# EasyEDA Pro project 2024-SS-ZT-2(第二次练习).eprj

# Schematic SCH

## Sheets
1 P1: Create Date: 2024-05-16; Page Name: P1; Project Name: 2024-SS-ZT-2(第二次练习); Schematic Name: SCH; Update Date: 2024-05-16; Company: 嘉立创EDA; Page Size: A4; Version: V1.0
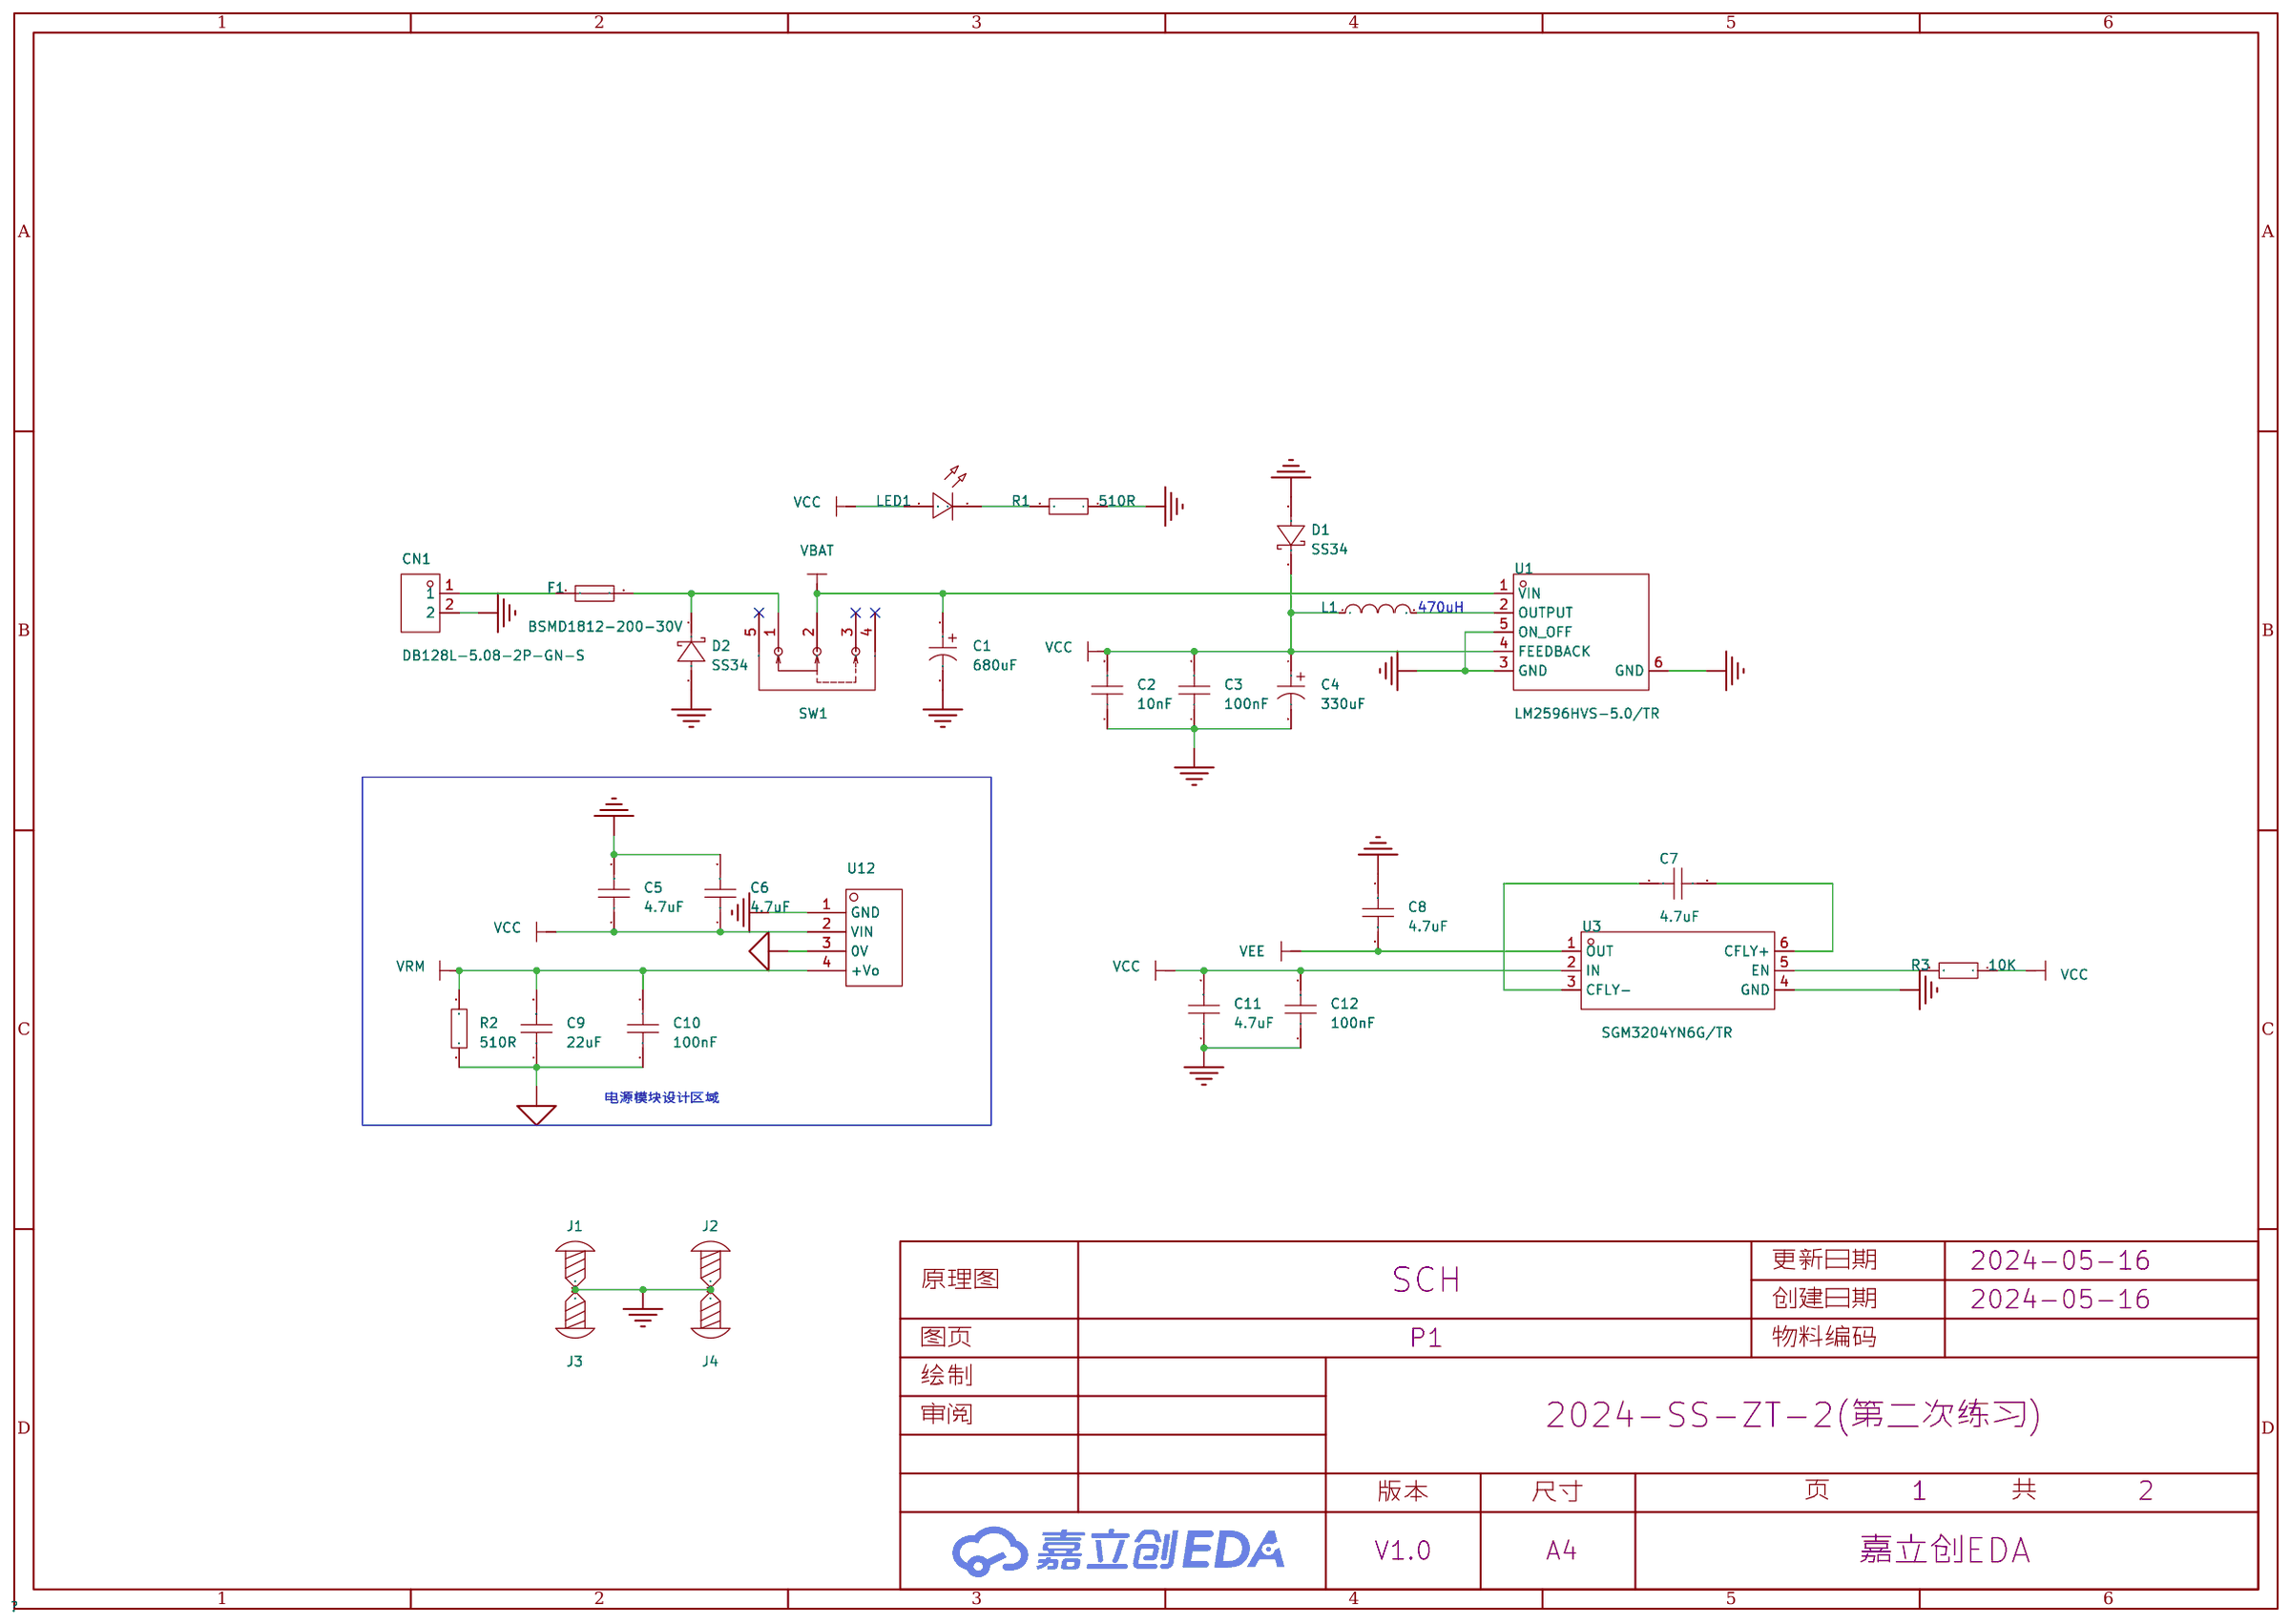
[diagram p0: P1]
2 P2: Page Name: P2; Company: EDA设计与开发
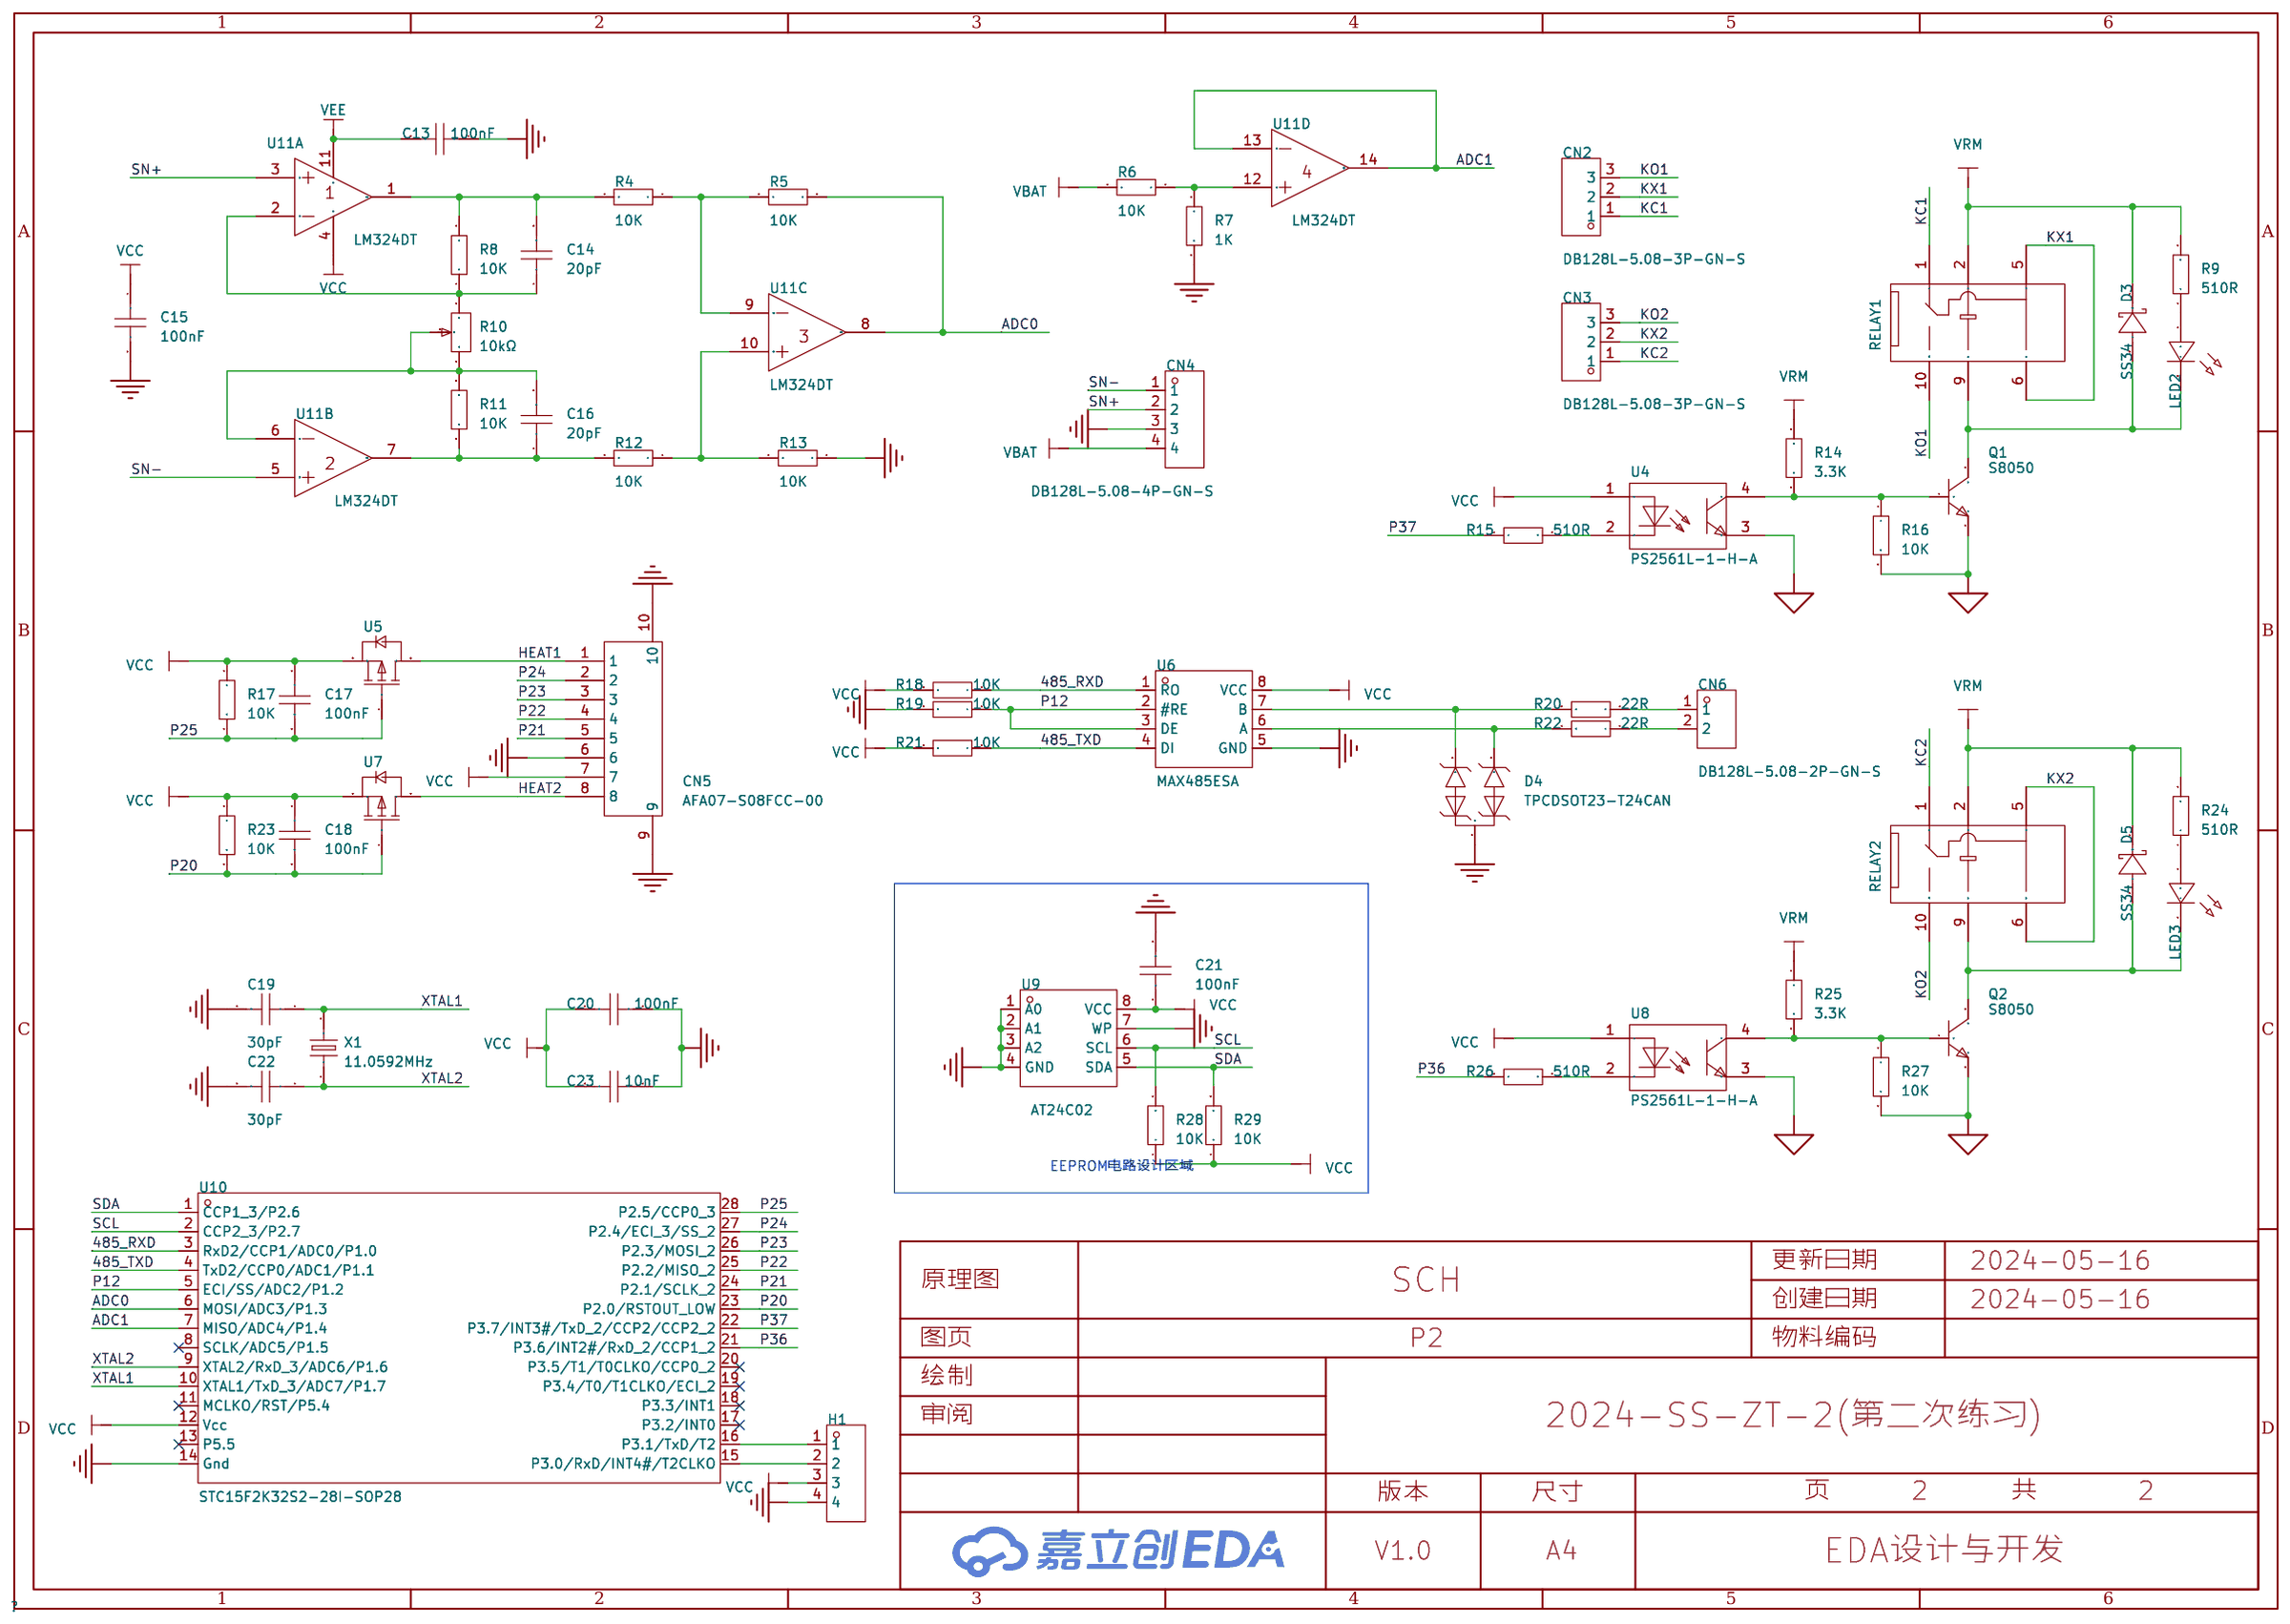
[diagram p1: P2]

## Parts
sheet P1
C1  680uF  [CAP-SMD_BD10.0-L10.3-W10.3-LS11.3-FD]
C2  10nF  [C0805]
C3  100nF  [C0805]
C4  330uF  [CAP-SMD_BD6.3-L6.6-W6.6-LS7.6-RD]
C5  4.7uF  [C1206]
C6  4.7uF  [C1206]
C7  4.7uF  [C1206]
C8  4.7uF  [C1206]
C9  22uF  [C1206]
C10  100nF  [C0805]
C11  4.7uF  [C1206]
C12  100nF  [C0805]
CN1  DB128L-5.08-2P-GN-S  [CONN-TH_2P-P5.08_DB128L-5.08-2P]
D1  SS34  [SMA_L4.3-W2.5-LS5.0-RD]
D2  SS34  [SMA_L4.3-W2.5-LS5.0-RD]
F1  BSMD1812-200-30V  [F1812]
J1  -  [M2螺丝]
J2  -  [M2螺丝]
J3  -  [M2螺丝]
J4  -  [M2螺丝]
L1  470uH  [IND-SMD_L12.0-W12.0_YPRH120X]
LED1  -  [LED_TH-3mm]
R1  510R  [R0805]
R2  510R  [R0805]
R3  10K  [R0805]
SW1  SK12D07VG4  [SW-TH_SK12D07VG4]
U1  LM2596HVS-5.0/TR  [TO-263-5_L10.2-W8.9-P1.70-LS15.2-BR]
U3  SGM3204YN6G/TR  [SOT-23-6_L2.9-W1.6-P0.95-LS2.8-BR]
U12  -  [TH_PCON]
sheet P2
C13  100nF  [C0805]
C14  20pF  [C0805]
C15  100nF  [C0805]
C16  20pF  [C0805]
C17  100nF  [C0805]
C18  100nF  [C0805]
C19  30pF  [C0805]
C20  100nF  [C0805]
C21  100nF  [C0805]
C22  30pF  [C0805]
C23  10nF  [C0805]
CN2  DB128L-5.08-3P-GN-S  [CONN-TH_DB128L-5.08-3P]
CN3  DB128L-5.08-3P-GN-S  [CONN-TH_DB128L-5.08-3P]
CN4  DB128L-5.08-4P-GN-S  [CONN-TH_4P_DB128L-5.08-4P-GN-S]
CN5  AFA07-S08FCC-00  [FPC-SMD_P1.00-8P_LCS-XJ-H2.5]
CN6  DB128L-5.08-2P-GN-S  [CONN-TH_2P-P5.08_DB128L-5.08-2P]
D3  SS34  [SMA_L4.3-W2.5-LS5.0-RD]
D4  TPCDSOT23-T24CAN  [SOT-23-3_L2.9-W1.3-P1.90-LS2.4-BR]
D5  SS34  [SMA_L4.3-W2.5-LS5.0-RD]
H1  -  [HDR-TH_4P-P2.54-V-F]
LED2  -  [LED_TH-3mm]
LED3  -  [LED_TH-3mm]
Q1  S8050  [SOT-23-3_L2.9-W1.3-P1.90-LS2.4-BR]
Q2  S8050  [SOT-23-3_L2.9-W1.3-P1.90-LS2.4-BR]
R4  10K  [R0805]
R5  10K  [R0805]
R6  10K  [R0805]
R7  1K  [R0805]
R8  10K  [R0805]
R9  510R  [R0805]
R10  10kΩ  [RES-ADJ-TH_3P-L10.0-W10.0-P2.50-BL-BS]
R11  10K  [R0805]
R12  10K  [R0805]
R13  10K  [R0805]
R14  3.3K  [R0805]
R15  510R  [R0805]
R16  10K  [R0805]
R17  10K  [R0805]
R18  10K  [R0805]
R19  10K  [R0805]
R20  22R  [R0805]
R21  10K  [R0805]
R22  22R  [R0805]
R23  10K  [R0805]
R24  510R  [R0805]
R25  3.3K  [R0805]
R26  510R  [R0805]
R27  10K  [R0805]
R28  10K  [R0805]
R29  10K  [R0805]
RELAY1  G5V-1 DC5  [RELAY-TH_G5V-1]
RELAY2  G5V-1 DC5  [RELAY-TH_G5V-1]
U4  PS2561L-1-H-A  [SOP-4_L6.5-W4.6-P2.54-LS9.6-TL]
U5  SI2301-ZE  [SOT-23-3_L2.9-W1.3-P1.90-LS2.4-BR]
U6  MAX485ESA  [SOP-8_L5.0-W4.0-P1.27-LS6.0-BL]
U7  SI2301-ZE  [SOT-23-3_L2.9-W1.3-P1.90-LS2.4-BR]
U8  PS2561L-1-H-A  [SOP-4_L6.5-W4.6-P2.54-LS9.6-TL]
U9  AT24C02  [SOP-8_L4.9-W3.9-P1.27-LS6.0-BL]
U10  STC15F2K32S2-28I-SOP28  [SOP-28_L17.9-W7.5-P1.27-LS10.3-BL]
U11  LM324DT  [SOIC-14_L8.7-W3.9-P1.27-LS6.0-BL]  (sections 1,2,3,4)
X1  11.0592MHz  [HC-49US_L11.5-W4.5-P4.88]

## Library data of the parts
C1 = 126RV0105: 容值:680uF;精度:±20%;额定电压:35V;纹波电流:380mA;; LCSC Part Name: 680uF ±20% 35V; Supplier Part: C7461236; Manufacturer: KNSCHA(科尼盛); Supplier Footprint: SMD,D10xL10.5mm; JLCPCB Part Class: Extended Part; Datasheet: https://atta.szlcsc.com/upload/public/pdf/source/20230711/6451BDCB5B323B6F7EF00B061BF0BEEC.pdf; Supplier: LCSC; Tolerance: ±20%; Rated Voltage: 35V; Ripple Current: 380mA; φD: 10mm; L: 10.5mm; Lifetime @ Temp: 2000hrs@105℃; Operating Temperature: -55℃~+105℃
C2 C3 C10 C12-C23 = CAP_0805: Supplier Footprint: 0805
C4 = 126RV0107: 容值:330uF;精度:±20%;额定电压:16V;纹波电流:170mA;; LCSC Part Name: 330uF ±20% 16V; Supplier Part: C7461238; Manufacturer: KNSCHA(科尼盛); Supplier Footprint: SMD,D6.3xL7.7mm; JLCPCB Part Class: Extended Part; Datasheet: https://atta.szlcsc.com/upload/public/pdf/source/20230711/6451BDCB5B323B6F7EF00B061BF0BEEC.pdf; Supplier: LCSC; Tolerance: ±20%; Rated Voltage: 16V; Ripple Current: 170mA; φD: 6.3mm; L: 7.7mm; Lifetime @ Temp: 2000hrs@105℃; Operating Temperature: -55℃~+105℃
C5-C9 C11 = CL31A226KOHNNNE: 容值:22uF;精度:±10%;额定电压:16V;材质(温度系数):X5R;; LCSC Part Name: 22uF ±10% 16V; Supplier Part: C90146; Manufacturer: SAMSUNG(三星); Supplier Footprint: 1206; JLCPCB Part Class: 扩展库; Datasheet: https://atta.szlcsc.com/upload/public/pdf/source/20161228/1482890861309.pdf; Supplier: LCSC; Tolerance: ±10%; Voltage Rated: 16V; Temperature Coefficient: X5R
CN1 CN6 = DB128L-5.08-2P-GN-S: 结构:1x2P;间距:5.08mm;颜色:绿色;安装方式:直插;额定电流:18A;额定电压:250V;排数:1;线规 - AWG:12~30;线规 - 平方毫米:2.5;每排PIN数:2;工作温度范围:-40℃~+105℃;; LCSC Part Name: 5.08mm 1x2P 排数:1 每排P数:2 直插; Supplier Part: C395868; Manufacturer: DORABO(地博电气); Supplier Footprint: 插件,P=5.08mm; JLCPCB Part Class: 扩展库; Datasheet: https://atta.szlcsc.com/upload/public/pdf/source/20230106/B067FE0E641A396A370D47F93C345689.pdf; Supplier: LCSC; Structure: 1x2P; Pitch: 5.08mm; Color: 绿色; Mounting Style: 直插; Current Rating (Max): 18A; Voltage Rating (Max): 250V; Number of Pins: 2P; Number of Rows: 1; Wire Gauge - AWG: 12~30; Wire Gauge - mm2: 2.5; Number of PINs Per Row: 2; Operating Temperature Range: -40℃~+105℃
D1-D3 D5 = SS34_C727060: 二极管配置:独立式;正向压降(Vf):550mV@3A;直流反向耐压(Vr):40V;平均整流电流(Io):3A;; LCSC Part Name: 电压:40V 电流:3A; Supplier Part: C727060; Manufacturer: TWGMC(台湾迪嘉); Supplier Footprint: SMA(DO-214AC); JLCPCB Part Class: 扩展库; Datasheet: https://atta.szlcsc.com/upload/public/pdf/source/20200828/C727059_6599B6CAC5F3238B9C33E46794659DBE.pdf; Supplier: LCSC; Diode Configuration: 独立式; Forward Voltage (Vf@If): 550mV@3A; Reverse Voltage (Vr): 40V; Average Rectified Current (Io): 3A; Reverse Leakage Current (Ir): 500uA@40V
F1 = BSMD1812-200-30V: 最大电压:30V;最大电流:40A;保持电流:2A;跳闸电流:4A;; LCSC Part Name: 30V 2A 1812自恢复; Supplier Part: C960026; Manufacturer: BHFUSE(佰宏); Supplier Footprint: 1812; JLCPCB Part Class: 扩展库; Datasheet: https://atta.szlcsc.com/upload/public/pdf/source/20230512/6ED7FF50F668B3AF958C55F12246A840.pdf; Supplier: LCSC; Operating Voltage (Max): 30V; Current Rating (Max): 40A; Hold Current: 2A; Trip Current: 4A; Power Dissipation: 1W; Resistance - Initial (Ri) (Min): 20mΩ; Resistance - Post Trip (R1) (Max): 100mΩ; Maximum Time to Trip: 2s; Operating Temperature: -40℃~+85℃
J1-J4 = M2螺丝: Supplier Footprint: 插件
L1 = YPRH1209-471M: 电感值:470uH;精度:±20%;额定电流:1.06A;; LCSC Part Name: 470uH ±20%; Supplier Part: C718309; Manufacturer: YJYCOIN(益嘉源); Supplier Footprint: SMD,12x12mm; JLCPCB Part Class: 扩展库; Datasheet: https://atta.szlcsc.com/upload/public/pdf/source/20200623/C339955_D39FA66995A9BB8553FDBD7D9E6E5CB5.pdf; Supplier: LCSC; Tolerance: ±20%; Rated Current: 1.06A; DC Resistance (DCR): 471mΩ
LED1 = LED_TH-R_3mm: Supplier Footprint: 插件
R1-R9 R11-R29 = Res_0805: Supplier Footprint: 0805
SW1 = SK12D07VG4: 电路结构:单刀双掷;安装方式:侧插;额定电流(DC):500mA;额定电压(DC):50V;额定电流(AC):-;额定电压(AC):-;机械寿命:5千次;; LCSC Part Name: 3脚2档位 卧插 滑动开关; Supplier Part: C393937; Manufacturer: SHOU HAN(首韩); Supplier Footprint: 插件; JLCPCB Part Class: 扩展库; Datasheet: https://atta.szlcsc.com/upload/public/pdf/source/20190521/C393937_939FE26E571CC67D2D532E953108A1B0.pdf; Supplier: LCSC; Circuit: 单刀双掷; Actuator Style: 矩形柱状; Pin Style: PC引脚; Switch Height: 8.8mm; Mounting Style: 侧插; Current Rating (DC): 500mA; Voltage Rating (DC): 50V; Mechanical Life: 5千次
U1 = LM2596HVS-5.0/TR: Supplier Part: C7421039; Manufacturer: HGSEMI(华冠); Supplier Footprint: TO-263-5; Datasheet: https://atta.szlcsc.com/upload/public/pdf/source/20230608/50F81A07F1CB4120FC66F79925E72406.pdf; Supplier: LCSC
U3 = SGM3204YN6G/TR: 功能类型:-;输入电压:1.4V~5.5V;输出电压:-5.5V~-1.4V;输出电流(最大值):200mA;; Supplier Part: C194031; Manufacturer: SGMICRO(圣邦微); Supplier Footprint: SOT-23-6; JLCPCB Part Class: 扩展库; Datasheet: https://atta.szlcsc.com/upload/public/pdf/source/20180627/C194031_755051E53122D645C36CF727711B963E.pdf; Supplier: LCSC; Input Voltage: 1.4V~5.5V; Output Voltage: -5.5V~-1.4V; Output Current (Max): 200mA; Switching Frequency: 950kHz; Number of Outputs: 1; Switch tube (built-in/external): 内置
U12 = PCON
CN2 CN3 = DB128L-5.08-3P-GN-S: 结构:1x3P;间距:5.08mm;颜色:绿色;安装方式:直插;额定电流:18A;额定电压:250V;排数:1;线规 - AWG:12~30;线规 - 平方毫米:2.5;每排PIN数:3;工作温度范围:-40℃~+105℃;; LCSC Part Name: 5.08mm 1x3P 排数:1 每排P数:3 直插; Supplier Part: C395869; Manufacturer: DORABO(地博电气); Supplier Footprint: 插件,P=5.08mm; JLCPCB Part Class: 扩展库; Datasheet: https://atta.szlcsc.com/upload/public/pdf/source/20230106/B067FE0E641A396A370D47F93C345689.pdf; Supplier: LCSC; Structure: 1x3P; Pitch: 5.08mm; Color: 绿色; Mounting Style: 直插; Current Rating (Max): 18A; Voltage Rating (Max): 250V; Number of Pins: 3P; Number of Rows: 1; Wire Gauge - AWG: 12~30; Wire Gauge - mm2: 2.5; Number of PINs Per Row: 3; Operating Temperature Range: -40℃~+105℃
CN4 = DB128L-5.08-4P-GN-S: 结构:1x4P;间距:5.08mm;颜色:绿色;安装方式:直插;额定电流:18A;额定电压:250V;排数:1;线规 - AWG:12~30;线规 - 平方毫米:2.5;每排PIN数:4;工作温度范围:-40℃~+105℃;; LCSC Part Name: 5.08mm 1x4P 排数:1 每排P数:4 直插; Supplier Part: C2827883; Manufacturer: DORABO(地博电气); Supplier Footprint: 插件,P=5.08mm; JLCPCB Part Class: 扩展库; Datasheet: https://atta.szlcsc.com/upload/public/pdf/source/20230106/B067FE0E641A396A370D47F93C345689.pdf; Supplier: LCSC; Structure: 1x4P; Pitch: 5.08mm; Color: 绿色; Mounting Style: 直插; Current Rating (Max): 18A; Voltage Rating (Max): 250V; Number of Pins: 4P; Number of Rows: 1; Wire Gauge - AWG: 12~30; Wire Gauge - mm2: 2.5; Number of PINs Per Row: 4; Operating Temperature Range: -40℃~+105℃
CN5 = AFA07-S08FCC-00: 锁定特性:抽屉式;触点类型:下接;触点数量:8P;间距:1mm;安装类型:卧贴;; LCSC Part Name: 间距:1mm P数:8P 抽屉式 下接; Supplier Part: C262342; Manufacturer: JS(钜硕电子); Supplier Footprint: SMD,P=1mm,卧贴; JLCPCB Part Class: 扩展库; Datasheet: https://atta.szlcsc.com/upload/public/pdf/source/20191217/C262716_30B15E9A77BFCA4A54741C92DB3BE8CC.pdf; Supplier: LCSC; Locking Feature: 抽屉式; Contact Type: 下接; Number of Contacts: 8P; Pitch: 1mm; Mounting Type: 卧贴; FFC, FCB Thickness: 0.3mm; Height Above Board: 2.5mm
D4 = TPCDSOT23-T24CAN: Supplier Part: C970033; Manufacturer: TECH PUBLIC(台舟); Supplier Footprint: SOT-23; JLCPCB Part Class: 扩展库; Datasheet: https://atta.szlcsc.com/upload/public/pdf/source/20230522/C1F3B36253468277A14BE124FFAB154C.pdf; Supplier: LCSC
H1 = HDR-F_2.54_1x4P: Supplier Part: C2718488; Supplier Footprint: 插件
LED2 LED3 = LED_TH-G_3mm: Supplier Footprint: 插件
Q1 Q2 = S8050_C2891804: 晶体管类型:NPN;集电极电流(Ic):500mA;集射极击穿电压(Vceo):25V;功率(Pd):300mW;; LCSC Part Name: NPN 电流:500mA 耐压:25V; Supplier Part: C2891804; Manufacturer: YONGYUTAI(永裕泰); Supplier Footprint: SOT-23; JLCPCB Part Class: Extended Part; Datasheet: https://atta.szlcsc.com/upload/public/pdf/source/20210901/5347316A10609C628D4D69AE01446E5B.pdf; Supplier: LCSC; Transistor Type: NPN; Collector Current (Ic): 500mA; Collector-Emitter Breakdown Voltage (Vceo): 25V; Power Dissipation (Pd): 300mW; Collector Cut-Off Current (Icbo): 1uA; Collector-Emitter Saturation Voltage (VCE(sat)@Ic,Ib): 500mV@500mA,50mA
R10 = 3296W-1-203LF: 阻值:20kΩ;精度:±10%;功率:500mW;温度系数:±100ppm/℃;; LCSC Part Name: 20kΩ ±10%; Supplier Part: C34845; Manufacturer: BOURNS; Supplier Footprint: 插件; JLCPCB Part Class: 扩展库; Datasheet: https://atta.szlcsc.com/upload/public/pdf/source/20151026/1457707506403.pdf; Supplier: LCSC; Tolerance: ±10%; Power(Watts): 500mW; Temperature Coefficient: ±100ppm/℃; Turns: 25
RELAY1 RELAY2 = G5V-1 DC5: 线圈电压:5V;触点形式:一组转换:1C(单刀双掷-转换);触点容量(电阻负载):-;最大切换电压:125V@AC；60V@DC;最大切换电流:1A;; LCSC Part Name: 继电器G5V-1-5VDC; Supplier Part: C28695; Manufacturer: OMRON(欧姆龙); Supplier Footprint: DIP,7.5x12.5mm; JLCPCB Part Class: 扩展库; Supplier: LCSC; Coil Voltage: 5V; Contact Form: 一组转换:1C(单刀双掷-转换); Maximum Switching Voltage: 125V@AC；60V@DC; Contact Material: 银+镀金; Maximum Switching Current: 1A; Operate Time: 5ms; Release Time: 5ms; Operating Temperature: -40℃~+70℃
U4 U8 = PS2561L-1-H-A: Supplier Part: C145672; Manufacturer: California Eastern Laboratories; Supplier Footprint: SOP-4-2.54mm; JLCPCB Part Class: 扩展库; Datasheet: https://atta.szlcsc.com/upload/public/pdf/source/20180125/C145673_15168615431091301608.pdf; Supplier: LCSC
U5 U7 = SI2301-ZE: 类型:P沟道;漏源电压(Vdss):20V;连续漏极电流(Id):2.3A;功率(Pd):700mW;导通电阻(RDS(on)@Vgs,Id):126mΩ@4.5V;阈值电压(Vgs(th)@Id):1V@250uA;; LCSC Part Name: P沟道 耐压:20V 电流:2.3A; Supplier Part: C5261052; Manufacturer: HXY MOSFET(华轩阳电子); Supplier Footprint: SOT-23; JLCPCB Part Class: 扩展库; Datasheet: https://atta.szlcsc.com/upload/public/pdf/source/20230515/2FF2907841563ED329594D3237822724.pdf; Supplier: LCSC; Type: P沟道; Drain Source Voltage (Vdss): 20V; Continuous Drain Current (Id): 2.3A; Power Dissipation (Pd): 700mW; Drain Source On Resistance (RDS(on)@Vgs,Id): 126mΩ@4.5V; Gate Threshold Voltage (Vgs(th)@Id): 1V@250uA; Input Capacitance (Ciss@Vds): 285pF
U6 = MAX485ESA_C668206: Supplier Part: C668206; Manufacturer: UMW(友台半导体); Supplier Footprint: SOP-8; JLCPCB Part Class: 扩展库; Datasheet: https://atta.szlcsc.com/upload/public/pdf/source/20231109/489730AE87B90C4B6B8CE65C07B1054C.pdf; Supplier: LCSC
U9 = AT24C02_C7470930: 接口类型:I2C;存储容量:2Kbit;时钟频率(fc):400kHz~1MHz;; LCSC Part Name: AT24C02  2Kbit 12C; Supplier Part: C7470930; Manufacturer: HXY MOSFET(华轩阳电子); Supplier Footprint: SOP-8; JLCPCB Part Class: 扩展库; Datasheet: https://atta.szlcsc.com/upload/public/pdf/source/20230913/748AF0FF0068DF582FAC58AD968E8A28.pdf; Supplier: LCSC; Interface Type: I2C; Memory Size: 2Kbit; Clock Frequency (fc): 400kHz~1MHz; Supply Voltage: 1.8V~5.5V; Data Retention - TDR (Year): 100年
U10 = STC15F2K32S2-28I-SOP28: LCSC Part Name: STC15F2K32S2-28I- SOP28; Supplier Part: C194605; Manufacturer: STC(宏晶); Supplier Footprint: SOP-28-300mil; JLCPCB Part Class: 扩展库; Datasheet: https://atta.szlcsc.com/upload/public/pdf/source/20180730/C194606_29BB2C4DE21484D9E9511E7CB40FB26F.pdf; Supplier: LCSC
U11 = LM324DT: 放大器数:四路;增益带宽积(GBP):1.3MHz;输入偏置电流(Ib):20nA;压摆率(SR):0.4V/us;带宽(-3db):-;; Supplier Part: C71035; Manufacturer: ST(意法半导体); Supplier Footprint: SOIC-14; JLCPCB Part Class: 基础库; Datasheet: https://atta.szlcsc.com/upload/public/pdf/source/20160408/1460100649718.pdf; Supplier: LCSC; Number of Circuits: 四路; Gain Bandwidth Product(GBP): 1.3MHz; Current - Input Bias(Ib): 20nA; Slew Rate(SR): 0.4V/us; Output Current: 40mA; Supply Current: 1.5mA; Operating Temperature: 0℃~+70℃
X1 = TAXD11.0592M2GLFBET2T: 晶振类型:直插晶振;频率:11.0592MHz;常温频差:±30ppm;外接负载电容:20pF;频率稳定度(全温):±30ppm;; LCSC Part Name: 11.0592MHz ±30ppm 20pF; Supplier Part: C127675; Manufacturer: YJX(雅晶鑫); Supplier Footprint: HC-49S; JLCPCB Part Class: 扩展库; Datasheet: https://atta.szlcsc.com/upload/public/pdf/source/20170914/C127676_1505359415156967690.pdf; Supplier: LCSC; Crystal Type: 直插晶振; Normal temperature Frequency Tolerance: ±30ppm; External load capacitor: 20pF; Frequency Stability(Full temperature range): ±30ppm; Equivalent Series Resistance (ESR): 50Ω; Operating Temperature: -20℃~+70℃

## Nets
GND: C1.2 C2.1 C3.1 C4.2 C5.2 C6.2 C8.1 C11.1 C12.1 C13.1 C15.2 C19.2 C20.1 C21.2 C22.2 C23.1 CN1.2 CN4.3 CN5.6 CN5.9 CN5.10 D1.2(A) D2.2(A) D4.3 H1.4 J1.1 J2.1 J3.1 J4.1 R1.1 R7.2 R13.1 R19.2 U1.3(GND) U1.5(ON_OFF) U1.6(GND) U3.4(GND) U6.5(GND) U9.1(A0) U9.2(A1) U9.3(A2) U9.4(GND) U9.7(WP) U10.14(Gnd) U12.1(GND)
VBAT: C1.1 CN4.4 R6.2 SW1.2 U1.1(VIN)
VCC: C2.2 C3.2 C4.1 C5.1 C6.1 C11.2 C12.2 C15.1 C17.1 C18.1 C20.2 C21.1 C23.2 CN5.7 D1.1(C) H1.3 L1.1 LED1.1(C) R3.1 R17.1 R18.2 R21.2 R23.1 R28.1 R29.1 U1.4(FEEDBACK) U3.2(IN) U4.1 U5.2(S) U6.8(VCC) U7.2(S) U8.1 U9.8(VCC) U10.12(Vcc) U11.4(VCC+) U12.2(VIN)
VEE: C8.2 C13.2 U3.1(OUT) U11.11(VCC-)
0: C9.1 C10.1 Q1.2(E) Q2.2(E) R2.1 R16.2 R27.2 U4.3 U8.3 U12.3(0V)
485_RXD: R18.1 U6.1(RO) U10.3(RxD2/CCP1/ADC0/P1.0)
485_TXD: R21.1 U6.4(DI) U10.4(TxD2/CCP0/ADC1/P1.1)
ADC0: R5.1 U10.6(MOSI/ADC3/P1.3) U11.8(OUT3)
ADC1: U10.7(MISO/ADC4/P1.4) U11.13(IN4-) U11.14(OUT4)
HEAT1: CN5.1 U5.3(D)
HEAT2: CN5.8 U7.3(D)
KC1: CN2.1 RELAY1.1
KC2: CN3.1 RELAY2.1
KO1: CN2.3 RELAY1.10
KO2: CN3.3 RELAY2.10
KX1: CN2.2 RELAY1.5 RELAY1.6
KX2: CN3.2 RELAY2.5 RELAY2.6
P12: R19.1 U6.2(#RE) U6.3(DE) U10.5(ECI/SS/ADC2/P1.2)
P20: C18.2 R23.2 U7.1(G) U10.23(P2.0/RSTOUT_LOW)
P21: CN5.5 U10.24(P2.1/SCLK_2)
P22: CN5.4 U10.25(P2.2/MISO_2)
P23: CN5.3 U10.26(P2.3/MOSI_2)
P24: CN5.2 U10.27(P2.4/ECI_3/SS_2)
P25: C17.2 R17.2 U5.1(G) U10.28(P2.5/CCP0_3)
P36: R26.1 U10.21(P3.6/INT2#/RxD_2/CCP1_2)
P37: R15.1 U10.22(P3.7/INT3#/TxD_2/CCP2/CCP2_2)
SCL: R28.2 U9.6(SCL) U10.2(CCP2_3/P2.7)
SDA: R29.2 U9.5(SDA) U10.1(CCP1_3/P2.6)
SN+: CN4.2 U11.3(IN1+)
SN-: CN4.1 U11.5(IN2+)
VRM: C9.2 C10.2 D3.1(C) D5.1(C) R2.2 R9.2 R14.1 R24.2 R25.1 RELAY1.2 RELAY2.2 U12.4(+Vo)
XTAL1: C19.1 U10.10(XTAL1/TxD_3/ADC7/P1.7) X1.2
XTAL2: C22.1 U10.9(XTAL2/RxD_3/ADC6/P1.6) X1.1
$1N5406: CN1.1 F1.1
$1N6010: L1.2 U1.2(OUTPUT)
$1N7874: R3.2 U3.5(EN)
$1N8048: C7.2 U3.6(CFLY+)
$1N8053: C7.1 U3.3(CFLY-)
$1N8284: LED1.2(A) R1.2
$1N8627: D2.1(C) F1.2 SW1.1
$2N2031: C16.1 R11.1 R12.2 U11.7(OUT2)
$2N2092: R12.1 R13.2 U11.10(IN3+)
$2N2099: R4.1 R5.2 U11.9(IN3-)
$2N2266: C14.1 R8.1 R10.1 U11.2(IN1-)
$2N2273: C14.2 R4.2 R8.2 U11.1(OUT1)
$2N2314: C16.2 R10.2 R10.3 R11.2 U11.6(IN2-)
$2N3023: CN6.1 R20.1
$2N3053: CN6.2 R22.1
$2N3244: D4.1 R22.2 U6.6(A)
$2N3251: D4.2 R20.2 U6.7(B)
$2N3377: R15.2 U4.2
$2N3466: Q1.1(B) R14.2 R16.1 U4.4
$2N4164: R26.2 U8.2
$2N4168: Q2.1(B) R25.2 R27.1 U8.4
$2N4738: LED2.1(C) R9.1
$2N4742: D3.2(A) LED2.2(A) Q1.3(C) RELAY1.9
$2N4893: LED3.1(C) R24.1
$2N4914: D5.2(A) LED3.2(A) Q2.3(C) RELAY2.9
$2N5025: R6.1 R7.1 U11.12(IN4+)
$2N7138: H1.1 U10.16(P3.1/TxD/T2)
$2N7141: H1.2 U10.15(P3.0/RxD/INT4#/T2CLKO)

Not connected (* = marked no-connect by the designer): SW1 3* 4* 5*; U10 8(SCLK/ADC5/P1.5)* 11(MCLKO/RST/P5.4)* 13(P5.5)* 17(P3.2/INT0)* 18(P3.3/INT1)* 19(P3.4/T0/T1CLKO/ECI_2)* 20(P3.5/T1/T0CLKO/CCP0_2)*

## Notes on the sheets
sheet 1
- 电源模块设计区域
sheet 2
- EEPROM电路设计区域

# Board PCB
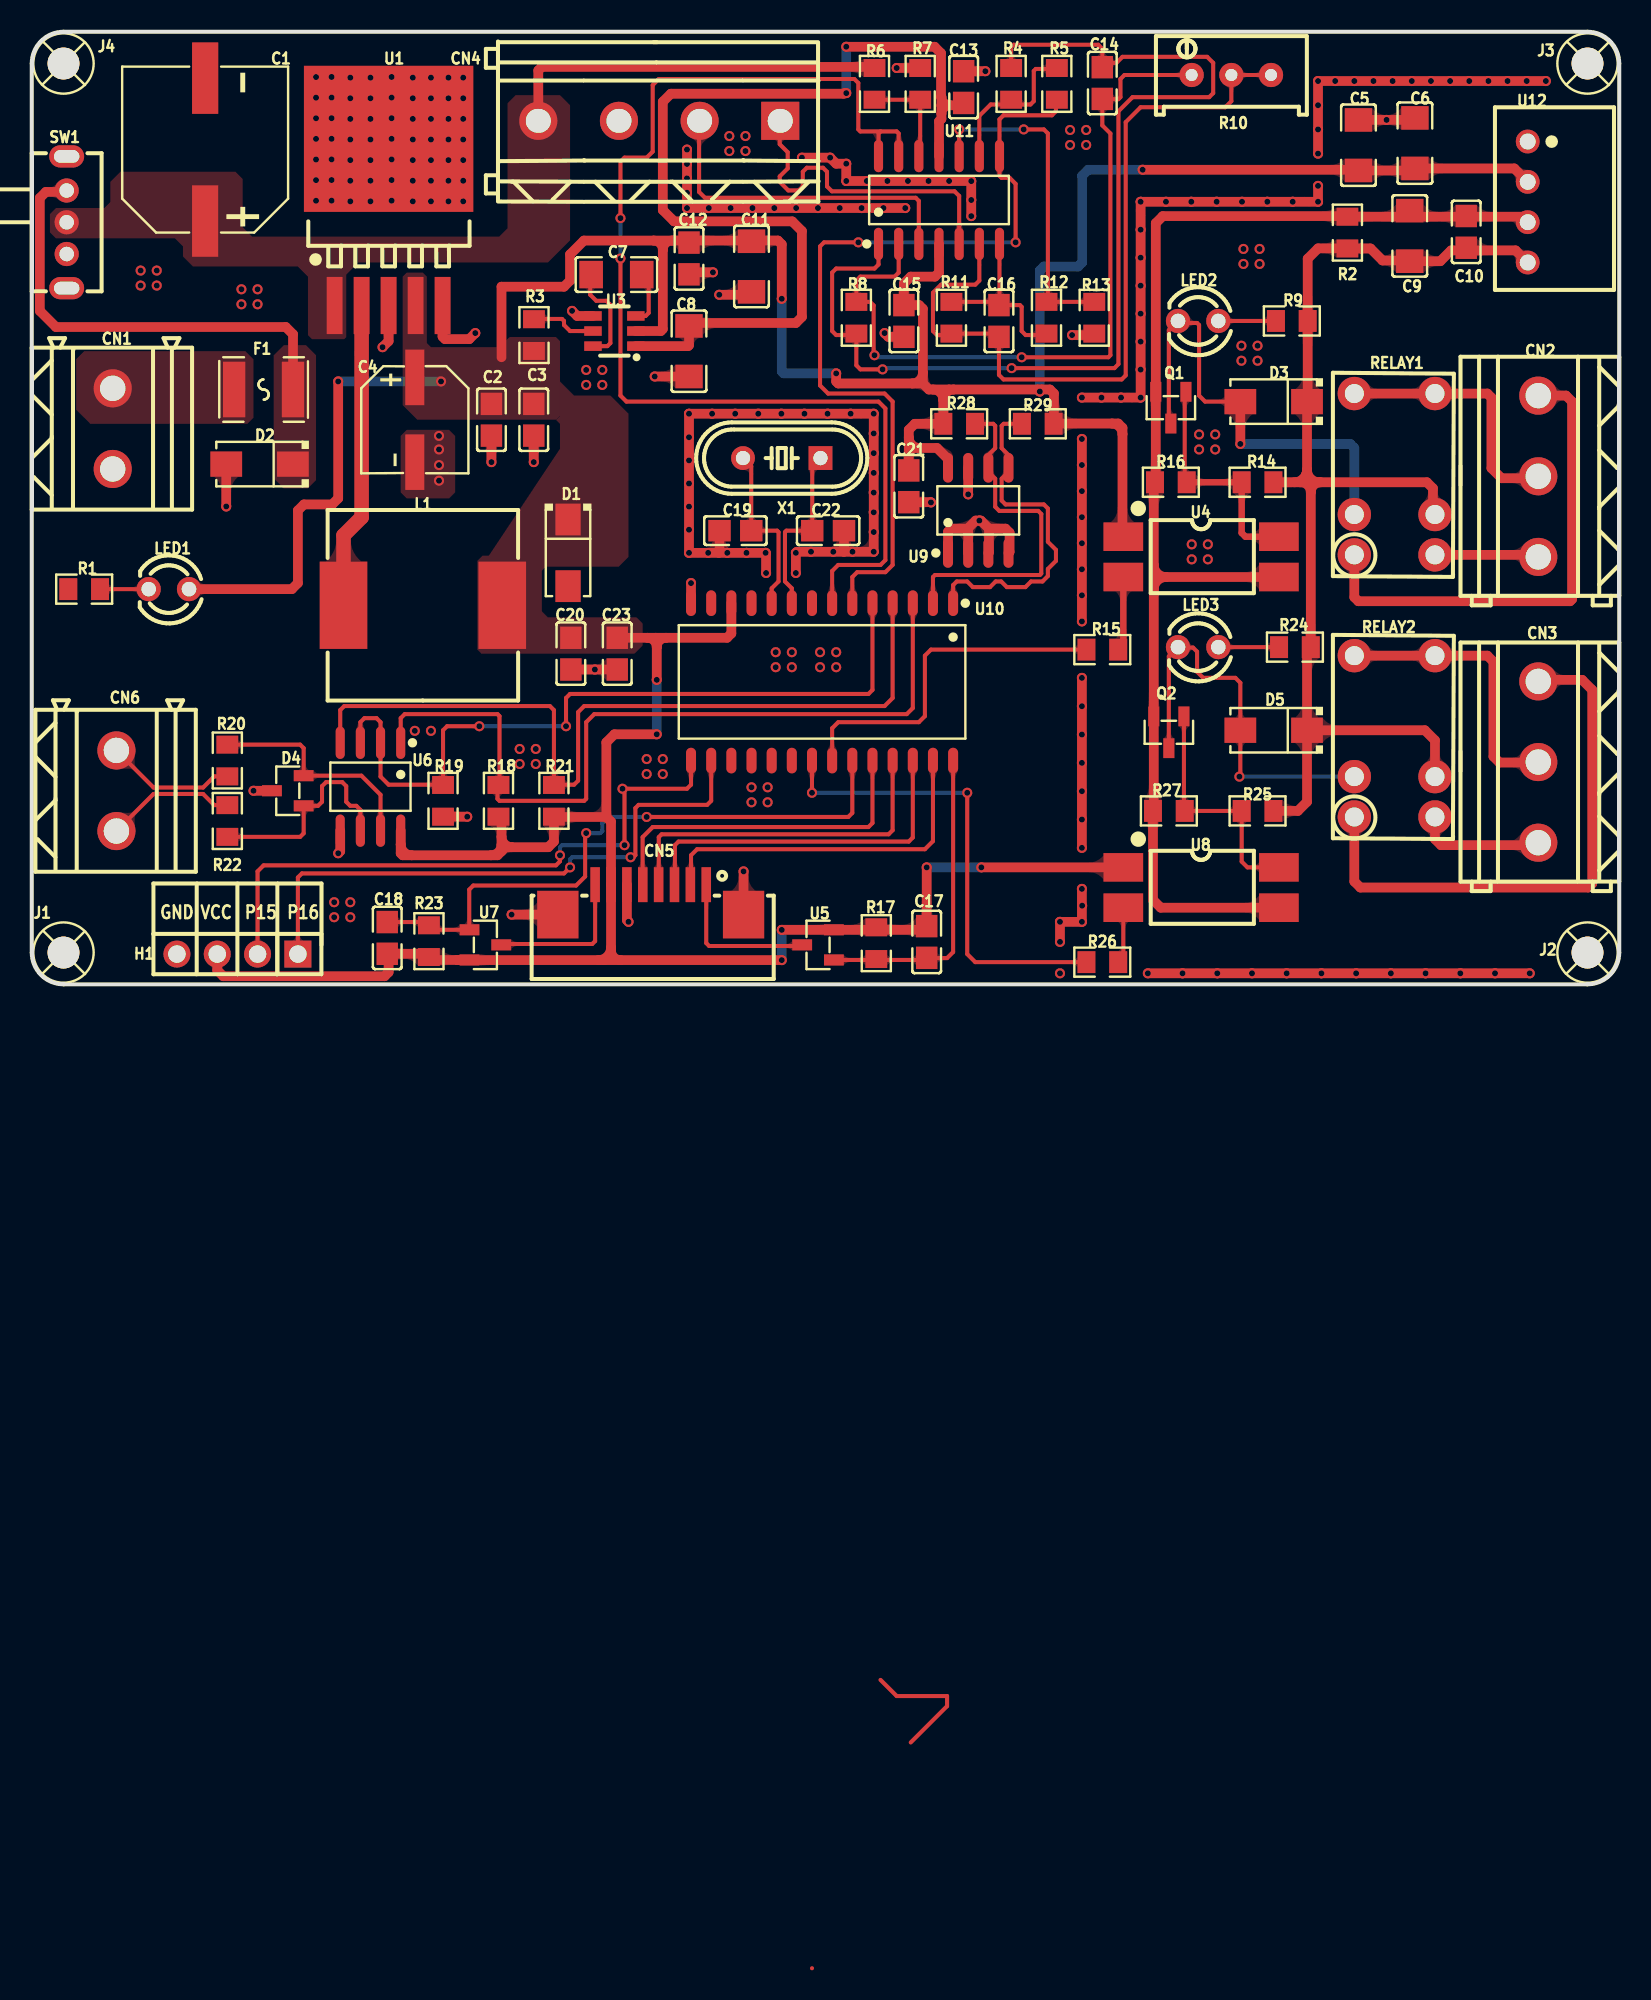
[diagram p2: board, top side]
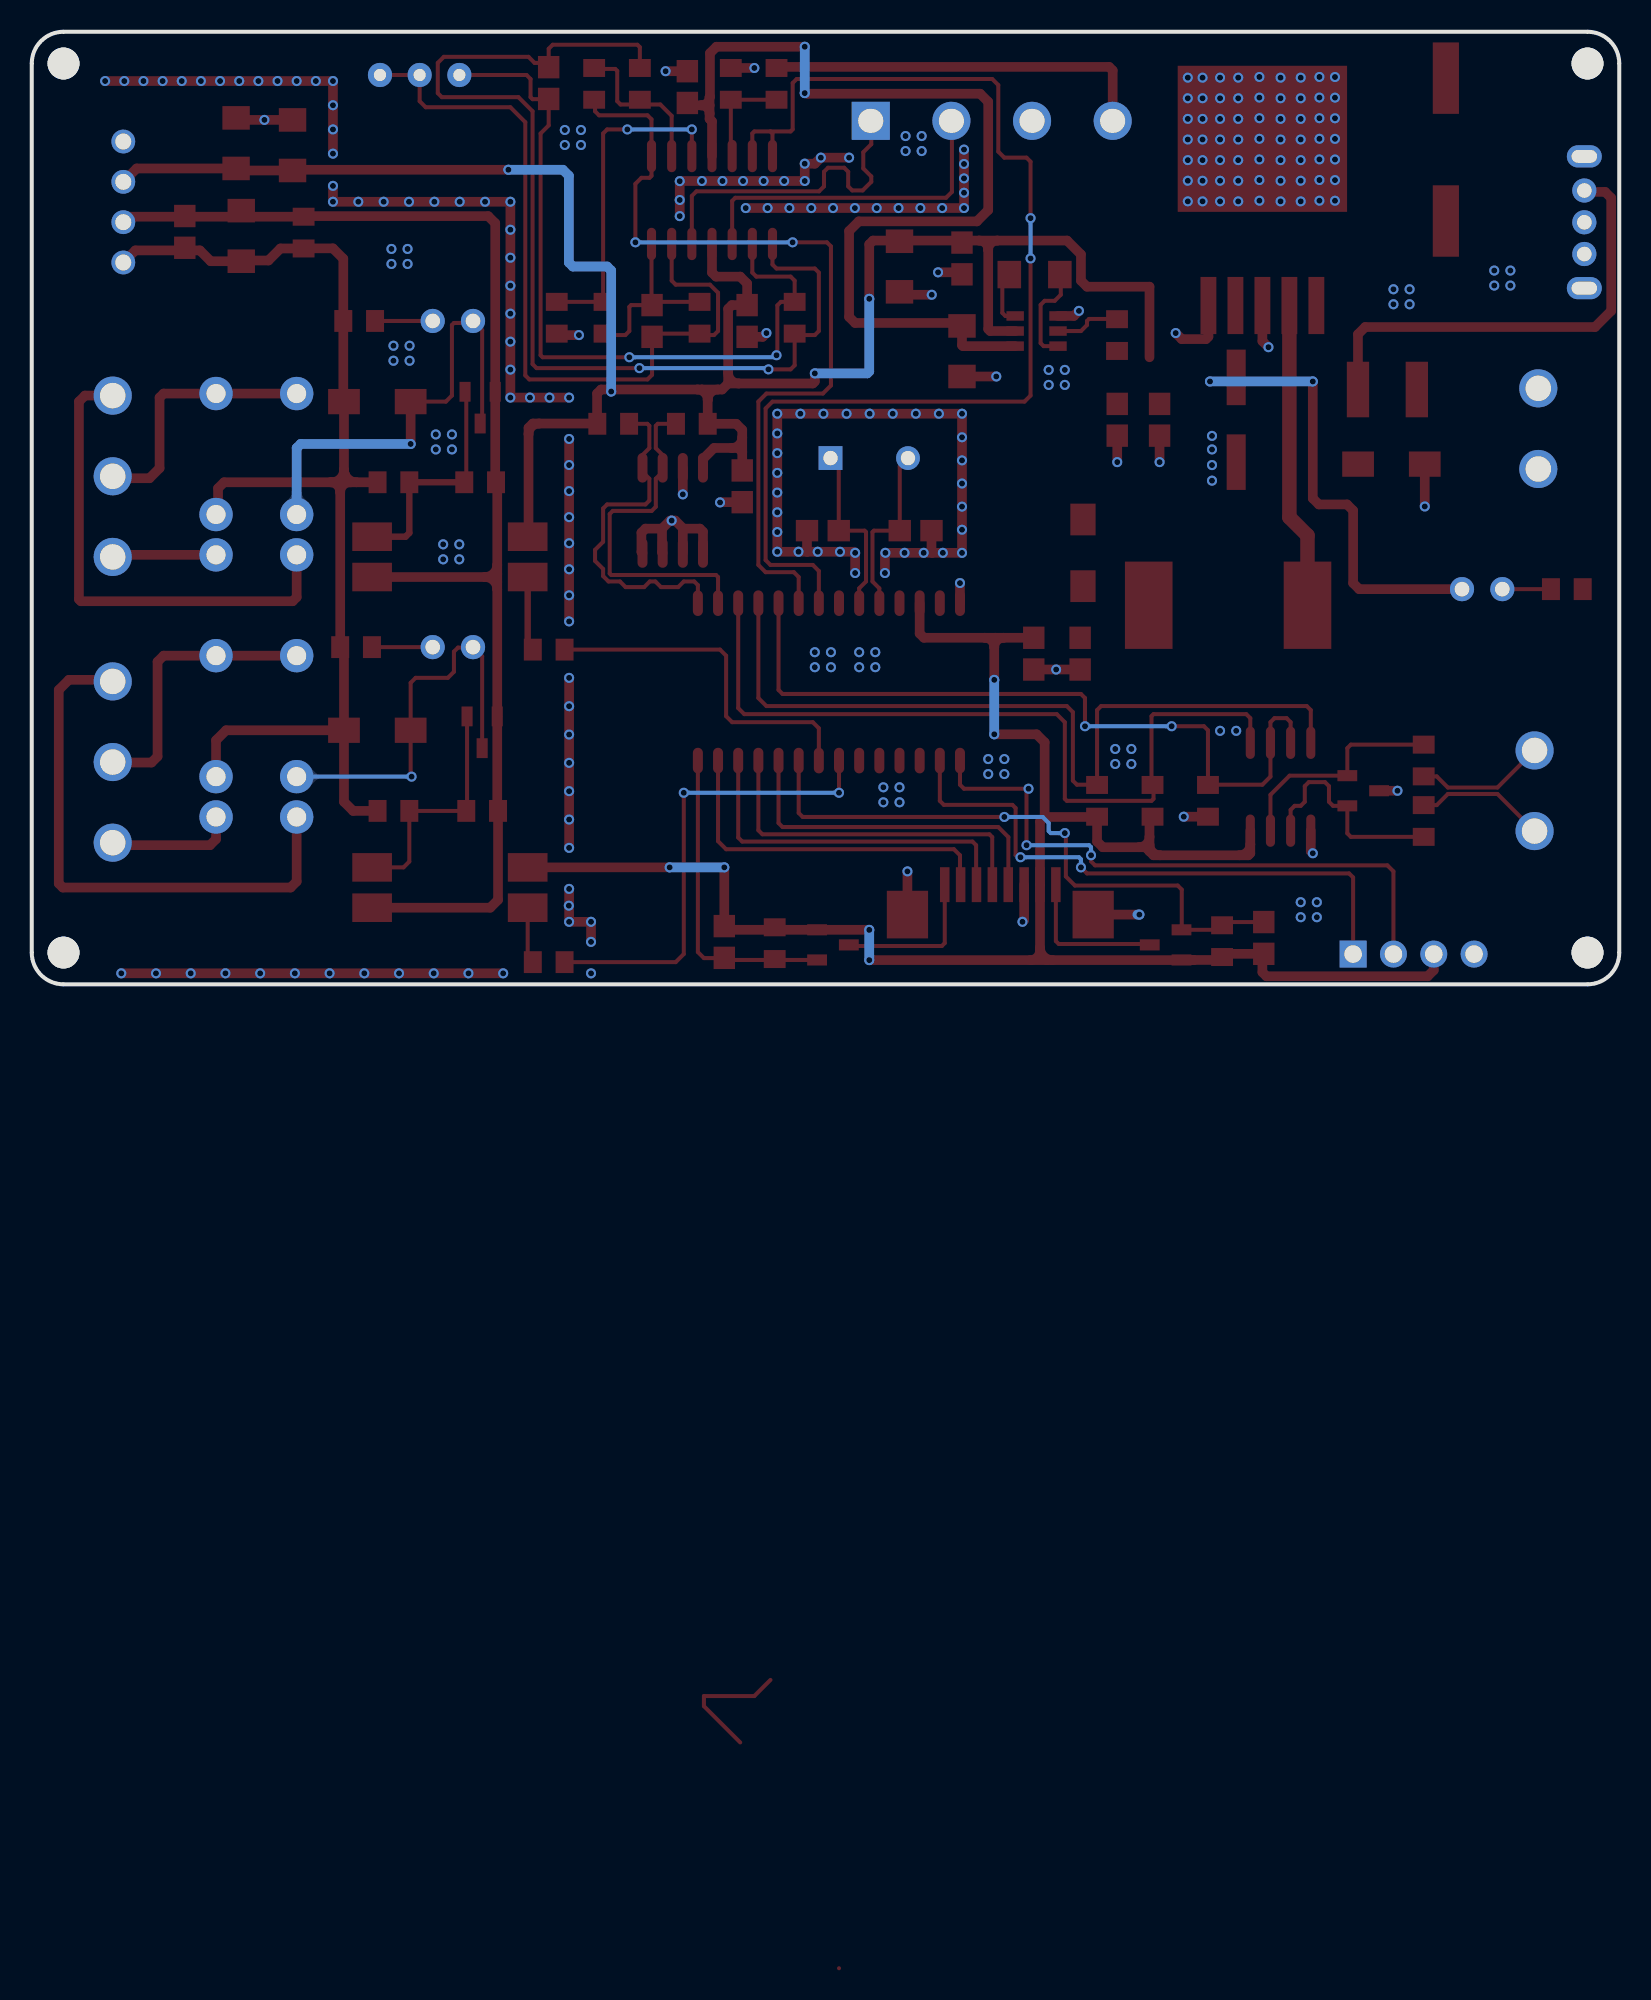
[diagram p3: board, bottom side, seen from below]

Outline 100 x 60 mm; copper layers: Top Layer, Bottom Layer. Coordinates in mm from the lower left corner of the outline.
Outline path: 0,58 0,2 arc(0.59,0.59) 2,0 98,0 arc(99.41,0.59) 100,2 100,58 arc(99.41,59.41) 98,60 2,60 arc(0.59,59.41) 0,58
Stack: Top Layer 0.035mm / Dielectric1 1.51mm FR4 er 4.5 / Bottom Layer 0.035mm

## Design rules (mm)
net SN+: DP4
net SN-: DP4
net $2N3251: DP2
net $2N3244: DP2
net $2N3023: DP1
net $2N3053: DP1
net SCL: DP5
net SDA: DP5
net XTAL2: DP3
net XTAL1: DP3
template: 自定义配置
spacing copperThickness1oz (default): track to track 0.203, other pairs 0.178 to 0.203
spacing copperThickness2oz: track to track 0.203, other pairs 0.152 to 0.3
track width copperThickness1oz (default): min 0.254, default 0.254, max 2.54
track width copperThickness2oz: min 0.203, default 0.254, max 2.54
track width PWR: min 0.254, default 0.61, max 2.54
differential pair differentialPair (default): width min 0.127, default 0.254, max 2.54; gap min 0.152, default 0.152
via viaSize (default): diameter min 0.635, default 0.635, max 10; hole min 0.381, default 0.381, max 6.299
net 0 uses PWR
net GND uses PWR
net VBAT uses PWR
net VCC uses PWR
net VRM uses PWR
net VEE uses PWR

## Placement (name value [footprint] x y rotation side)
C1  680uF  [CAP-SMD_BD10.0-L10.3-W10.3-LS11.3-FD]  10.92 52.58 90 top
C2  10nF  [C0805]  28.96 35.56 90 top
C3  100nF  [C0805]  31.62 35.56 90 top
C4  330uF  [CAP-SMD_BD6.3-L6.6-W6.6-LS7.6-RD]  24.13 35.56 270 top
C5  4.7uF  [C1206]  83.57 52.85 90 top
C6  4.7uF  [C1206]  87.13 52.98 90 top
C7  4.7uF  [C1206]  36.83 44.7 180 top
C8  4.7uF  [C1206]  41.4 39.88 90 top
C9  22uF  [C1206]  86.8 47.14 270 top
C10  100nF  [C0805]  90.36 47.39 270 top
C11  4.7uF  [C1206]  45.34 45.21 90 top
C12  100nF  [C0805]  41.4 45.72 90 top
C13  100nF  [C0805]  58.7 56.52 270 top
C14  20pF  [C0805]  67.44 56.77 90 top
C15  100nF  [C0805]  54.94 41.78 270 top
C16  20pF  [C0805]  60.93 41.78 270 top
C17  100nF  [C0805]  56.37 2.67 270 top
C18  100nF  [C0805]  22.39 2.92 90 top
C19  30pF  [C0805]  44.32 28.58 180 top
C20  100nF  [C0805]  33.96 20.83 90 top
C21  100nF  [C0805]  55.25 31.37 270 top
C22  30pF  [C0805]  50.16 28.58 0 top
C23  10nF  [C0805]  36.88 20.83 90 top
CN1  DB128L-5.08-2P-GN-S  [CONN-TH_2P-P5.08_DB128L-5.08-2P]  5.1 35 270 top
CN2  DB128L-5.08-3P-GN-S  [CONN-TH_DB128L-5.08-3P]  94.9 32 90 top
CN3  DB128L-5.08-3P-GN-S  [CONN-TH_DB128L-5.08-3P]  94.9 14 90 top
CN4  DB128L-5.08-4P-GN-S  [CONN-TH_4P_DB128L-5.08-4P-GN-S]  39.53 54.39 0 top
CN5  AFA07-S08FCC-00  [FPC-SMD_P1.00-8P_LCS-XJ-H2.5]  38.99 5.33 180 top
CN6  DB128L-5.08-2P-GN-S  [CONN-TH_2P-P5.08_DB128L-5.08-2P]  5.33 12.19 270 top
D1  SS34  [SMA_L4.3-W2.5-LS5.0-RD]  33.78 27.18 270 top
D2  SS34  [SMA_L4.3-W2.5-LS5.0-RD]  14.35 32.77 180 top
D3  SS34  [SMA_L4.3-W2.5-LS5.0-RD]  78.23 36.7 180 top
D4  TPCDSOT23-T24CAN  [SOT-23-3_L2.9-W1.3-P1.90-LS2.4-BR]  16.13 12.19 0 top
D5  SS34  [SMA_L4.3-W2.5-LS5.0-RD]  78.23 16 180 top
F1  BSMD1812-200-30V  [F1812]  14.61 37.47 0 top
H1  -  [HDR-TH_4P-P2.54-V-F]  12.95 1.91 180 top
J1  -  [M2螺丝]  2 2 0 top
J2  -  [M2螺丝]  98 2 0 top
J3  -  [M2螺丝]  98 58 0 top
J4  -  [M2螺丝]  2 58 0 top
L1  470uH  [IND-SMD_L12.0-W12.0_YPRH120X]  24.64 23.88 180 top
LED1  -  [LED_TH-3mm]  8.64 24.89 180 top
LED2  -  [LED_TH-3mm]  73.47 41.78 180 top
LED3  -  [LED_TH-3mm]  73.47 21.24 180 top
Q1  S8050  [SOT-23-3_L2.9-W1.3-P1.90-LS2.4-BR]  71.75 36.32 90 top
Q2  S8050  [SOT-23-3_L2.9-W1.3-P1.90-LS2.4-BR]  71.63 15.88 90 top
R1  510R  [R0805]  3.3 24.89 0 top
R2  510R  [R0805]  82.87 47.35 270 top
R3  10K  [R0805]  31.64 40.89 90 top
R4  10K  [R0805]  61.69 56.72 90 top
R5  10K  [R0805]  64.57 56.72 90 top
R6  10K  [R0805]  53.09 56.72 90 top
R7  1K  [R0805]  55.96 56.72 90 top
R8  10K  [R0805]  51.94 41.99 270 top
R9  510R  [R0805]  79.38 41.78 0 top
R10  10kΩ  [RES-ADJ-TH_3P-L10.0-W10.0-P2.50-BL-BS]  75.56 57.28 90 top
R11  10K  [R0805]  57.93 41.99 270 top
R12  10K  [R0805]  63.92 41.99 270 top
R13  10K  [R0805]  66.93 41.99 90 top
R14  3.3K  [R0805]  77.22 31.62 180 top
R15  510R  [R0805]  67.44 21.08 0 top
R16  10K  [R0805]  71.75 31.62 180 top
R17  10K  [R0805]  53.2 2.59 270 top
R18  10K  [R0805]  29.4 11.56 270 top
R19  10K  [R0805]  25.91 11.56 270 top
R20  22R  [R0805]  12.32 14.1 90 top
R21  10K  [R0805]  32.89 11.56 270 top
R22  22R  [R0805]  12.32 10.29 270 top
R23  10K  [R0805]  25.02 2.72 90 top
R24  510R  [R0805]  79.57 21.24 0 top
R25  3.3K  [R0805]  77.22 10.92 180 top
R26  510R  [R0805]  67.44 1.4 0 top
R27  10K  [R0805]  71.63 10.92 180 top
R28  10K  [R0805]  58.42 35.31 0 top
R29  10K  [R0805]  63.37 35.31 180 top
RELAY1  G5V-1 DC5  [RELAY-TH_G5V-1]  85.85 32.13 90 top
RELAY2  G5V-1 DC5  [RELAY-TH_G5V-1]  85.85 15.62 90 top
SW1  SK12D07VG4  [SW-TH_SK12D07VG4]  2.2 48 270 top
U1  LM2596HVS-5.0/TR  [TO-263-5_L10.2-W8.9-P1.70-LS15.2-BR]  22.48 48.01 270 top
U3  SGM3204YN6G/TR  [SOT-23-6_L2.9-W1.6-P0.95-LS2.8-BR]  36.7 41.15 0 top
U4  PS2561L-1-H-A  [SOP-4_L6.5-W4.6-P2.54-LS9.6-TL]  73.66 26.92 0 top
U5  SI2301-ZE  [SOT-23-3_L2.9-W1.3-P1.90-LS2.4-BR]  49.53 2.48 0 top
U6  MAX485ESA  [SOP-8_L5.0-W4.0-P1.27-LS6.0-BL]  21.34 12.45 180 top
U7  SI2301-ZE  [SOT-23-3_L2.9-W1.3-P1.90-LS2.4-BR]  28.57 2.48 180 top
U8  PS2561L-1-H-A  [SOP-4_L6.5-W4.6-P2.54-LS9.6-TL]  73.66 6.1 0 top
U9  AT24C02  [SOP-8_L4.9-W3.9-P1.27-LS6.0-BL]  59.62 29.85 0 top
U10  STC15F2K32S2-28I-SOP28  [SOP-28_L17.9-W7.5-P1.27-LS10.3-BL]  49.78 19.05 180 top
U11  LM324DT  [SOIC-14_L8.7-W3.9-P1.27-LS6.0-BL]  57.15 49.4 0 top
U12  -  [TH_PCON]  94.23 53.09 270 top
X1  11.0592MHz  [HC-49US_L11.5-W4.5-P4.88]  47.24 33.15 180 top

## Footprints (pads in the part's own frame, mm; a bottom-side part is the same pattern mirrored in y, then rotated)
C0805
  rect 1.41x1.35 smd: 1(-1,0) 2(1,0)
C1206
  rect 1.485x1.728 smd: 1(-1.593,0) 2(1.593,0)
CAP-SMD_BD6.3-L6.6-W6.6-LS7.6-RD
  rect 3.5x1.2 smd: 1(-2.67,0) 2(2.67,0)
CAP-SMD_BD10.0-L10.3-W10.3-LS11.3-FD
  rect 4.5x1.65 smd: 1(-4.5,0) 2(4.5,0)
CONN-TH_2P-P5.08_DB128L-5.08-2P
  round 2.4 hole 1.6: 1(-2.54,0) 2(2.54,0)
CONN-TH_4P_DB128L-5.08-4P-GN-S
  rect 2.4x2.4 hole 1.575x1.5: 1(7.62,0)
  round 2.4 hole 1.575x1.5: 2(2.54,0) 3(-2.54,0) 4(-7.62,0)
CONN-TH_DB128L-5.08-3P
  round 2.4 hole 1.6: 1(-5.08,0) 2(0,0) 3(5.08,0)
F1812
  rect 1.407x3.499 smd: 1(-1.853,0) 2(1.853,0)
FPC-SMD_P1.00-8P_LCS-XJ-H2.5
  rect 0.6x2.2 smd: 1(-3.499,-0.943) 2(-2.499,-0.943) 3(-1.5,-0.943) 4(-0.499,-0.943) 5(0.5,-0.943) 6(1.5,-0.943) 7(2.5,-0.943) 8(3.5,-0.943)
  rect 2.6x3 smd: 9(5.85,0.943) 10(-5.85,0.943)
HC-49US_L11.5-W4.5-P4.88
  rect 1.5x1.5 hole 0.9: 1(-2.44,0)
  round 1.5 hole 0.9: 2(2.44,0)
HDR-TH_4P-P2.54-V-F
  rect 1.7x1.7 hole 1.1: 1(-3.81,0)
  round 1.7 hole 1.1: 2(-1.27,0) 3(1.27,0) 4(3.81,0)
IND-SMD_L12.0-W12.0_YPRH120X
  rect 3x5.5 smd: 1(-5,0) 2(5,0)
LED_TH-3mm
  round 1.524 hole 0.914: 1(-1.27,0) 2(1.27,0)
M2螺丝
  round 2 hole 2: 1(0,0)
R0805
  rect 1.133x1.377 smd: 1(-1,0) 2(1,0)
RELAY-TH_G5V-1
  round 2.1 hole 1.2: 1(-5.08,-2.54) 2(-2.54,-2.54) 5(5.08,-2.54) 6(5.08,2.54) 9(-2.54,2.54) 10(-5.08,2.54)
RES-ADJ-TH_3P-L10.0-W10.0-P2.50-BL-BS
  round 1.524 hole 0.762: 1(0,2.5) 2(0,0) 3(0,-2.5)
SMA_L4.3-W2.5-LS5.0-RD
  rect 2x1.593 smd: 1(-2.1,0) 2(2.1,0)
SOIC-14_L8.7-W3.9-P1.27-LS6.0-BL
  oval 0.574x2.038 smd: 1(-3.81,-2.769) 2(-2.54,-2.769) 3(-1.27,-2.769) 4(0,-2.769) 5(1.27,-2.769) 6(2.54,-2.769) 7(3.81,-2.769) 8(3.81,2.769) 9(2.54,2.769) 10(1.27,2.769) 11(0,2.769) 12(-1.27,2.769) 13(-2.54,2.769) 14(-3.81,2.769)
SOP-4_L6.5-W4.6-P2.54-LS9.6-TL
  rect 2.5x1.8 smd: 1(-4.9,1.27) 2(-4.9,-1.27) 3(4.9,-1.27) 4(4.9,1.27)
SOP-8_L4.9-W3.9-P1.27-LS6.0-BL
  oval 0.63x1.865 smd: 1(-1.905,-2.683) 2(-0.635,-2.683) 3(0.635,-2.683) 4(1.905,-2.683) 5(1.905,2.683) 6(0.635,2.683) 7(-0.635,2.683) 8(-1.905,2.683)
SOP-8_L5.0-W4.0-P1.27-LS6.0-BL
  oval 0.574x2.035 smd: 1(-1.905,-2.768) 2(-0.635,-2.768) 3(0.635,-2.768) 4(1.905,-2.768) 5(1.905,2.768) 6(0.635,2.768) 7(-0.635,2.768) 8(-1.905,2.768)
SOP-28_L17.9-W7.5-P1.27-LS10.3-BL
  oval 0.63x1.615 smd: 1(-8.255,-4.957) 2(-6.985,-4.957) 3(-5.715,-4.957) 4(-4.445,-4.957) 5(-3.175,-4.957) 6(-1.905,-4.957) 7(-0.635,-4.957) 8(0.635,-4.957) 9(1.905,-4.957) 10(3.175,-4.957) 11(4.445,-4.957) 12(5.715,-4.957) 13(6.985,-4.957) 14(8.255,-4.957) 15(8.255,4.957) 16(6.985,4.957) 17(5.715,4.957) 18(4.445,4.957) 19(3.175,4.957) 20(1.905,4.957) 21(0.635,4.957) 22(-0.635,4.957) 23(-1.905,4.957) 24(-3.175,4.957) 25(-4.445,4.957) 26(-5.715,4.957) 27(-6.985,4.957) 28(-8.255,4.957)
SOT-23-3_L2.9-W1.3-P1.90-LS2.4-BR
  rect 1.25x0.7 smd: 1(1,-0.95) 2(1,0.95) 3(-1,0)
SOT-23-6_L2.9-W1.6-P0.95-LS2.8-BR
  rect 1.1x0.6 smd: 1(1.35,-0.95) 2(1.35,0) 3(1.35,0.95) 4(-1.35,0.95) 5(-1.35,0) 6(-1.35,-0.95)
SW-TH_SK12D07VG4
  round 1.524 hole 0.914: 1(-2,0) 2(0,0) 3(2,0)
  oval 1.4x2.2 hole 0.8x1.6: 4(4.15,0) 5(-4.15,0)
TH_PCON
  round 1.5 hole 1: 1(0,0) 2(2.54,0) 3(5.08,0) 4(7.62,0)
TO-263-5_L10.2-W8.9-P1.70-LS15.2-BR
  rect 3.6x1 smd: 1(5.25,-3.4) 2(5.25,-1.7) 3(5.25,0) 4(5.25,1.7) 5(5.25,3.4)
  rect 9.2x10.668 smd: 6(-5.25,0)

## Nets
As in the schematic.

Pads without a net: SW1 3 4 5; U10 8 11 13 17 18 19 20

## Via types
v1: diameter 0.635, hole 0.381, Top Layer to Bottom Layer, 318 vias

## Routing (per net, layer and track width the routed paths; a pad name or vN(x,y) marks a point on that pad's centre or on a via; arc(x,y) is an arc through that point)
GND: length 233.1
  Top Layer w0.61: CN5.9 v1(30.23,4.39) ; v1(46.26,25.91) 46.26,27.15 v1(46.23,27.18) v1(45.02,27.18) v1(43.81,27.18) 43.28,27.18 ; v1(48.13,25.91) v1(48.13,27.18) 48.2,27.25 v1(49.09,27.25) v1(50.49,27.25) 51.15,27.25 ; 43.28,27.18 43.32,27.22 C19.2 ; 43.28,27.18 v1(42.61,27.18) v1(41.4,27.18) v1(41.4,28.63) v1(41.4,30.09) v1(41.4,31.55) v1(41.4,33) v1(41.4,34.46) v1(41.4,35.94) v1(42.86,35.94) v1(44.31,35.94) v1(45.76,35.94) v1(47.22,35.94) v1(48.67,35.94) v1(50.13,35.94) v1(51.58,35.94) v1(53.04,35.94) v1(53.04,34.7) v1(53.04,33.46) v1(53.04,32.21) v1(53.04,30.97) v1(53.04,29.73) v1(53.04,28.49) v1(53.04,27.25) v1(51.7,27.25) 51.15,27.25 ; U9.4 61.59,27.24 61.59,28.45 61.34,28.7 60.3,28.7 ; 60.3,28.7 59.79,29.21 v1(59.69,29.21) 59.46,29.21 58.96,28.7 ; 60.3,28.7 60.3,27.21 U9.3 ; R13.1 66.84,40.89 v1(65.53,40.89) ; v1(19.3,8.25) 19.43,8.38 U6.5 ; C5.2 v1(85.34,54.45) 87,54.45 C6.2 ; U10.14 v1(41.53,25.27) ; 58.96,28.7 58.99,28.67 U9.2 ; 58.96,28.7 57.91,28.7 57.72,28.51 U9.1 ; R7.2 v1(54.48,57.72) ; v1(34.04,42.42) 34.36,42.1 U3.4 ; 45.34,43.75 45.03,43.43 v1(43.31,43.43) ; v1(53.72,41.02) 53.96,40.78 C15.2 ; C23.1 v1(35.47,19.83) C20.1 ; v1(56.64,30.35) 56.63,30.37 C21.2 ; v1(66.15,6.01) v1(66.15,3.94) v1(64.77,3.94) v1(64.77,2.67) ; v1(81.03,52.32) v1(81.03,53.85) v1(81.03,55.37) v1(81.03,56.9) v1(82.11,56.9) v1(83.31,56.9) v1(84.52,56.9) v1(85.72,56.9) v1(86.93,56.9) v1(88.14,56.9) v1(89.34,56.9) v1(90.55,56.9) v1(91.76,56.9) v1(92.96,56.9) v1(94.17,56.9) v1(95.38,56.9) ; v1(66.15,36.96) v1(67.38,36.96) v1(68.62,36.96) v1(69.85,36.96) v1(69.85,38.72) v1(69.85,40.48) v1(69.85,42.24) v1(69.85,44.01) v1(69.85,45.77) v1(69.85,47.53) v1(69.85,49.29) v1(71.45,49.29) v1(73.04,49.29) v1(74.64,49.29) v1(76.24,49.29) v1(77.83,49.29) v1(79.43,49.29) v1(81.03,49.29) v1(81.03,50.29) ; v1(66.15,19.3) v1(66.15,17.52) v1(66.15,15.73) v1(66.15,13.95) v1(66.15,12.16) v1(66.15,10.38) v1(66.15,8.6) ; v1(41.28,52.58) v1(41.28,51.67) v1(41.28,50.77) v1(41.28,49.86) v1(41.28,48.89) v1(42.65,48.89) v1(44.02,48.89) v1(45.4,48.89) v1(46.77,48.89) v1(48.15,48.89) v1(49.52,48.89) v1(50.9,48.89) v1(52.27,48.89) v1(53.65,48.89) v1(55.02,48.89) ; U9.7 v1(58.99,30.86) ; R19.2 v1(27.43,10.56) ; C2.1 v1(28.96,32.89) ; 51.15,27.25 51.16,27.26 C22.2 ; U1.5 25.88,40.8 26.03,40.64 27.56,40.64 v1(27.94,41.02) ; CN5.6 37.49,4.04 v1(37.59,3.94) ; D2.2 v1(12.25,30.1) ; v1(22.1,40.13) 22.48,40.51 U1.3 ; v1(66.15,34.35) v1(66.15,32.71) v1(66.15,31.07) v1(66.15,29.43) v1(66.15,27.78) v1(66.15,26.14) v1(66.15,24.5) v1(66.15,22.86) ; 41.4,44.85 v1(42.91,44.85) ; v1(59.18,48.39) v1(59.18,49.4) v1(59.18,50.59) 59.17,50.6 v1(57.78,50.6) v1(56.49,50.6) v1(55.19,50.6) v1(53.9,50.6) v1(52.6,50.6) v1(51.31,50.6) v1(51.31,51.69) 50.67,51.69 v1(50.29,52.07) v1(48.51,52.07) ; CN5.10 v1(44.84,7.11) ; C13.1 v1(60.07,57.52) ; D4.3 v1(13.97,12.19) ; C3.1 v1(31.62,32.89) ; v1(70.3,0.69) v1(72.49,0.69) v1(74.68,0.69) v1(76.87,0.69) v1(79.05,0.69) v1(81.24,0.69) v1(83.43,0.69) v1(85.61,0.69) v1(87.8,0.69) v1(89.99,0.69) v1(92.17,0.69) v1(94.36,0.69) ; C8.1 v1(39.24,38.29)
  Bottom Layer w0.61: v1(30.23,4.39) 30.35,4.39
  vias: v1(6.86,44.96) v1(6.86,44.01) v1(7.87,44.96) v1(7.87,44.01) v1(13.21,43.78) v1(13.21,42.83) v1(14.22,43.78) v1(14.22,42.83) v1(17.91,57.15) v1(17.91,55.85) v1(17.91,54.55) v1(17.91,53.25) v1(17.91,51.95) v1(17.91,50.65) v1(17.91,49.36) v1(18.89,57.15) v1(18.89,55.86) v1(18.89,54.56) v1(18.89,53.26) v1(18.89,51.96) v1(18.89,50.66) v1(18.89,49.36) v1(19.05,5.17) v1(19.05,4.23) v1(20.07,57.11) v1(20.07,55.81) v1(20.07,54.51) v1(20.07,53.21) v1(20.07,51.91) v1(20.07,50.62) v1(20.07,49.32) v1(20.07,5.17) v1(20.07,4.23) v1(21.34,57.11) v1(21.34,55.81) v1(21.34,54.51) v1(21.34,53.21) v1(21.34,51.91) v1(21.34,50.62) v1(21.34,49.32) v1(22.67,57.15) v1(22.67,55.85) v1(22.67,54.55) v1(22.67,53.26) v1(22.67,51.96) v1(22.67,50.66) v1(22.67,49.36) v1(24,57.11) v1(24,55.81) v1(24,54.51) v1(24,53.21) v1(24,51.91) v1(24,50.62) v1(24,49.32) v1(24.13,15.97) v1(25.15,57.11) v1(25.15,55.81) v1(25.15,54.51) v1(25.15,53.21) v1(25.15,51.91) v1(25.15,50.62) v1(25.15,49.32) v1(25.15,15.97) v1(25.65,34.54) v1(25.65,33.69) v1(25.65,32.71) v1(25.65,31.72) v1(26.25,57.11) v1(26.25,55.81) v1(26.25,54.51) v1(26.25,53.21) v1(26.25,51.91) v1(26.25,50.62) v1(26.25,49.32) v1(27.18,57.11) v1(27.18,55.81) v1(27.18,54.51) v1(27.18,53.21) v1(27.18,51.91) v1(27.18,50.62) v1(27.18,49.32) v1(30.73,14.82) v1(30.73,13.88) v1(31.75,14.82) v1(31.75,13.88) v1(34.93,38.7) v1(34.93,37.75) v1(35.94,38.7) v1(35.94,37.75) v1(38.74,14.19) v1(38.74,13.24) v1(39.75,14.19) v1(39.75,13.24) v1(43.94,53.43) v1(43.94,52.49) v1(44.96,53.43) v1(44.96,52.49) v1(45.34,12.41) v1(45.34,11.47) v1(46.35,12.41) v1(46.35,11.47) v1(46.86,20.92) v1(46.86,19.97) v1(47.88,20.92) v1(47.88,19.97) v1(49.66,20.92) v1(49.66,19.97) v1(50.67,20.92) v1(50.67,19.97) v1(64.77,0.69) v1(65.41,53.81) v1(65.41,52.87) v1(66.17,4.95) v1(66.42,53.81) v1(66.42,52.87) v1(73.07,27.71) v1(73.07,26.77) v1(73.53,34.64) v1(73.53,33.69) v1(74.09,27.71) v1(74.09,26.77) v1(74.55,34.64) v1(74.55,33.69) v1(76.2,40.22) v1(76.2,39.28) v1(76.33,46.32) v1(76.33,45.37) v1(77.22,40.22) v1(77.22,39.28) v1(77.34,46.32) v1(77.34,45.37)
VBAT: length 24.5
  Top Layer w0.61: R6.2 53.02,57.78 32.13,57.78 31.91,57.56 CN4.4
VCC: length 298
  Top Layer w0.61: 36.19,10.54 36.19,15.24 36.7,15.75 v1(39.37,15.75) ; 36.19,10.54 36.49,10.25 CN5.7 36.49,2.31 ; 36.19,10.54 32.91,10.54 R21.2 32.89,9 32.53,8.64 30.25,8.64 ; 39.17,46.85 34.78,46.85 33.91,45.97 33.91,44.32 33.53,43.94 29.59,43.94 29.59,39.5 ; 39.17,46.85 40.32,46.85 ; 39.17,46.85 arc(39.58,46.68) 39.75,46.27 ; 56.13,38.51 56.13,37.85 ; 56.13,38.51 56.13,42.55 55.9,42.78 C15.1 54.94,44.14 55.37,44.58 56.9,44.58 57.15,44.83 U11.4 ; 56.13,38.51 arc(55.94,38.04) 55.47,37.85 ; 56.13,37.85 56.51,37.47 56.77,37.47 ; 56.13,37.85 55.47,37.85 ; 30.25,8.64 29.84,8.64 29.59,8.38 ; 30.25,8.64 arc(29.78,8.83) 29.59,9.29 ; v1(19.3,37.97) 19.3,30.61 18.92,30.23 17.14,30.23 16.76,29.84 16.76,25.27 16.38,24.89 LED1.1 ; 22.48,1.92 22.48,0.76 22.22,0.51 12.06,0.51 11.68,0.89 H1.3 ; 22.48,1.92 24.82,1.92 R23.1 25.2,1.53 26.81,1.53 ; 22.48,1.92 C18.1 ; 55.25,33.53 55.25,34.44 ; 55.25,33.53 C21.1 ; 55.25,33.53 55.5,33.78 55.91,33.78 ; 55.25,34.44 55.25,34.92 55.63,35.31 R28.1 57.42,36.82 ; 55.25,34.44 arc(55.44,33.98) 55.91,33.78 ; 63.63,37.47 64.13,37.47 64.39,37.21 64.39,35.32 ; 63.63,37.47 63.37,37.47 ; 63.63,37.47 v1(63.5,37.34) 63.37,37.47 ; 29.59,8.38 29.34,8.13 28.93,8.13 ; 29.59,8.38 29.59,8.79 ; 57.78,37.47 57.42,37.1 57.42,36.82 ; 57.78,37.47 56.77,37.47 ; 57.78,37.47 58.07,37.47 ; 23.93,8.13 23.37,8.13 23.24,8.25 23.24,8.81 ; 23.93,8.13 28.93,8.13 ; 23.93,8.13 arc(23.44,8.33) 23.24,8.81 ; 64.39,35.32 R29.1 ; 64.39,35.32 68.04,35.32 ; 36.07,1.52 35.7,1.52 ; 36.07,1.52 37.09,1.52 ; 36.07,1.52 36.49,1.94 36.49,2.13 ; 35.7,1.52 26.82,1.52 26.81,1.53 ; 35.7,1.52 arc(36.26,1.75) 36.49,2.31 ; 29.59,9.29 29.59,10.37 R18.2 ; 29.59,9.29 29.59,8.79 ; 28.93,8.13 arc(29.4,8.32) 29.59,8.79 ; 45.25,46.85 45.34,46.93 ; 45.25,46.85 47.01,46.85 47.24,46.61 v1(47.24,43.18) ; 45.25,46.85 40.32,46.85 ; 39.37,21.24 v1(39.37,19.18) ; 39.37,21.24 39.37,21.77 39.31,21.83 ; 39.37,21.24 arc(39.54,21.66) 39.96,21.83 ; 39.37,21.24 arc(39.2,21.66) 38.78,21.83 ; 26.81,1.53 27.58,1.53 ; v1(47.24,1.52) 37.09,1.52 ; 37.09,1.52 arc(36.67,1.7) 36.49,2.13 ; 57.72,32.28 57.72,33.09 57.02,33.78 55.91,33.78 ; 68.04,35.32 68.44,35.32 68.71,35.05 68.71,34.66 ; 68.04,35.32 arc(68.51,35.13) 68.71,34.66 ; 63.37,37.47 58.07,37.47 ; 58.07,37.47 arc(57.61,37.28) 57.42,36.82 ; v1(50.67,38.48) 50.67,37.97 50.8,37.85 55.47,37.85 ; v1(59.82,7.37) U8.1 ; 56.77,37.47 arc(57.23,37.28) 57.42,36.82 ; 68.71,34.66 68.71,28.25 U4.1 ; U10.12 44.07,22.1 43.8,21.83 39.96,21.83 ; 39.31,21.83 39.96,21.83 ; 39.31,21.83 38.78,21.83 ; 36.49,2.31 36.49,2.13 ; v1(69.98,51.31) 83.53,51.31 C5.1 87,51.26 C6.1 93.39,51.39 U12.2 ; v1(47.24,3.43) 47.25,3.43 U5.2 56.14,3.43 C17.1 v1(56.37,7.37) ; 23.24,8.81 U6.8 ; 40.32,46.85 arc(39.92,46.68) 39.75,46.28 39.75,46.27 ; 39.75,46.27 39.75,41.28 39.62,41.15 U3.2 ; 38.78,21.83 C23.2
  Bottom Layer w0.61: v1(47.24,1.52) v1(47.24,3.43) ; v1(69.98,51.31) 66.55,51.31 66.17,50.93 66.17,45.47 65.91,45.21 63.75,45.21 63.5,44.96 v1(63.5,37.34) ; v1(19.3,37.97) v1(25.78,37.97) ; v1(47.24,43.18) 47.24,38.61 47.37,38.48 v1(50.67,38.48) ; v1(59.82,7.37) v1(56.37,7.37) ; v1(39.37,15.75) v1(39.37,19.18)
VEE: length 63.9
  Top Layer w0.61: 57.3,55.89 57.28,55.92 57.28,58.65 56.87,59.06 v1(51.31,59.06) ; 57.3,55.89 57.3,55.37 ; 57.3,55.89 arc(57.46,55.52) 57.83,55.37 ; C8.2 41.4,40.26 41.34,40.2 U3.1 ; 58.83,55.52 58.68,55.37 57.83,55.37 ; 57.3,55.37 57.83,55.37 ; 57.3,55.37 57.3,54.84 ; 57.83,55.37 arc(57.46,55.21) 57.3,54.84 ; 41.53,41.66 48.13,41.66 48.51,42.04 48.51,47.45 47.9,48.06 40.46,48.06 39.75,48.77 39.75,55.59 40.26,56.1 51.14,56.1 51.18,56.13 v1(51.31,56.13) ; 57.3,54.84 57.3,54.51 57.15,54.36 U11.11
  Bottom Layer w0.61: v1(51.31,56.13) v1(51.31,59.06)
(no net): length 8.5
  Top Layer w0.254: 53.47,-43.81 54.48,-44.83 57.66,-44.83 57.66,-45.47 55.37,-47.75
0: length 85.2
  Top Layer w0.61: 70.68,31.57 70.81,31.7 Q1.2 70.81,47.94 71.25,48.39 82.84,48.39 R2.1 90.31,48.35 ; 70.68,31.57 70.68,26.42 ; 70.68,31.57 70.63,31.62 ; 70.68,25.34 70.68,25.84 ; 70.68,25.34 70.99,25.65 71.44,25.65 ; 70.68,25.34 70.68,24.89 ; 70.68,25.84 70.68,26.42 ; 70.68,25.84 70.74,25.78 ; 71.44,25.65 U4.3 ; 71.44,25.65 arc(70.9,25.88) 70.68,26.42 ; 71.44,25.65 arc(70.9,25.43) 70.68,24.89 ; 90.31,48.35 C10.1 ; 90.31,48.35 93.89,48.35 U12.3 ; 70.68,24.89 Q2.2 70.68,10.97 R27.2 70.63,5.32 71.12,4.83 U8.3
485_RXD: length 51.3
  Top Layer w0.254: U10.3 55.5,17.4 55.12,17.02 35.43,17.02 34.93,16.51 34.93,11.68 34.8,11.56 29.46,11.56 29.34,11.68 29.34,12.49 R18.1 29.46,12.62 29.46,16.89 29.34,17.02 23.5,17.02 23.24,16.76 U6.1
485_TXD: length 52.6
  Top Layer w0.254: U10.4 54.23,18.03 53.72,17.53 34.8,17.53 34.42,17.14 34.42,12.83 34.16,12.57 32.91,12.57 R21.1 32.89,17.27 32.64,17.53 19.69,17.53 19.43,17.27 U6.4
ADC0: length 54
  Top Layer w0.254: v1(52.07,46.74) 49.91,46.74 49.66,46.48 49.66,37.72 50.16,37.21 53.72,37.21 54.23,36.7 54.23,26.42 53.77,25.96 51.99,25.96 51.69,25.65 U10.6 ; v1(61.98,46.74) 61.98,50.42 61.59,50.8 61.09,50.8 60.96,50.93 U11.8 60.96,54.48 61.21,54.74 64.26,54.74 64.52,54.99 64.52,55.66 R5.1
  Bottom Layer w0.254: v1(52.07,46.74) v1(61.98,46.74)
ADC1: length 75.3
  Top Layer w0.254: 53.47,53.72 53.34,53.59 U11.14 ; 53.47,53.72 54.48,53.72 54.61,53.59 U11.13 ; 53.47,53.72 52.2,53.72 52.07,53.85 52.07,56.77 51.82,57.02 39.5,57.02 39.12,56.64 39.12,52.45 38.74,52.07 37.34,52.07 37.08,51.82 v1(37.08,48.26) ; 50.42,24.01 50.42,26.03 50.8,26.42 53.47,26.42 53.77,26.72 53.77,36.27 53.34,36.7 37.47,36.7 37.08,37.08 v1(37.08,45.72)
  Bottom Layer w0.254: v1(37.08,48.26) v1(37.08,45.72)
HEAT1: length 9.8
  Top Layer w0.254: U5.3 48.46,2.41 42.67,2.41 42.49,2.6 CN5.1
HEAT2: length 9.6
  Top Layer w0.254: CN5.8 35.49,2.72 35.31,2.54 29.63,2.54 U7.3
KC1: length 6.6
  Top Layer w0.61: RELAY1.1 94.77,27.05 CN2.1
KC2: length 8.1
  Top Layer w0.61: CN3.1 94.74,8.76 88.77,8.76 88.39,9.14 RELAY2.1
KO1: length 31.3
  Top Layer w0.61: RELAY1.10 83.31,24.38 83.57,24.13 96.9,24.13 97.03,24.26 97.03,36.7 96.65,37.08 94.9,37.08 CN2.3
KO2: length 35.2
  Top Layer w0.61: CN3.3 95,19.18 97.66,19.18 98.3,18.54 98.3,6.35 98.04,6.1 83.69,6.1 83.31,6.48 RELAY2.10
KX1: length 16.5
  Top Layer w0.61: CN2.2 94.78,31.88 92.58,31.88 91.95,32.51 91.95,36.96 91.69,37.21 RELAY1.5 RELAY1.6
KX2: length 17.9
  Top Layer w0.61: CN3.2 94.87,13.97 92.46,13.97 92.07,14.35 92.07,20.32 91.69,20.7 RELAY2.5 RELAY2.6
P12: length 48.4
  Top Layer w0.254: U10.5 52.96,18.54 52.71,18.29 33.91,18.29 33.66,18.03 v1(33.66,16.26) ; U6.3 20.7,16.51 20.95,16.76 21.72,16.76 21.97,16.51 U6.2 21.97,13.08 22.48,12.57 25.89,12.57 R19.1 25.91,16 26.16,16.26 v1(28.19,16.26)
  Bottom Layer w0.254: v1(33.66,16.26) v1(28.19,16.26)
P20: length 39.2
  Top Layer w0.254: U10.23 51.69,10.79 51.44,10.54 v1(38.74,10.54) ; v1(34.93,9.53) 34.86,9.46 34.86,6.79 34.29,6.22 27.81,6.22 27.56,5.97 27.56,3.45 27.58,3.43 25.3,3.43 R23.2 24.82,3.92 C18.2
  Bottom Layer w0.254: v1(34.93,9.53) 35.81,9.53 35.94,9.65 35.94,10.16 36.32,10.54 v1(38.74,10.54)
P21: length 21.8
  Top Layer w0.254: U10.24 52.96,10.16 52.71,9.91 39.12,9.91 38.48,9.27 38.48,6.28 CN5.5
P22: length 22.3
  Top Layer w0.254: U10.25 54.23,9.7 53.97,9.45 39.68,9.45 39.5,9.27 39.5,6.28 CN5.4
P23: length 22.5
  Top Layer w0.254: U10.26 55.5,9.25 55.25,8.99 40.74,8.99 40.51,8.76 40.51,6.3 CN5.3
P24: length 22.6
  Top Layer w0.254: U10.27 56.77,9.02 56.26,8.51 41.91,8.51 41.53,8.13 41.53,6.32 CN5.2
P25: length 19.8
  Top Layer w0.254: U5.1 56.24,1.53 C17.2 56.39,1.65 57.66,1.65 58.04,2.03 U10.28
P36: length 29.7
  Top Layer w0.254: R26.1 59.44,1.4 58.93,1.91 v1(58.93,12.06) ; v1(49.15,12.06) U10.21
  Bottom Layer w0.254: v1(49.15,12.06) v1(58.93,12.06)
P37: length 22.3
  Top Layer w0.254: R15.1 56.64,21.08 56.26,20.7 56.26,16.89 55.88,16.51 50.8,16.51 50.42,16.13 50.42,14.09
SCL: length 22.2
  Top Layer w0.254: R28.2 60.56,35.31 60.69,35.18 60.69,33.77 60.26,33.34 60.26,32.28 60.69,31.85 60.69,30.08 60.95,29.82 63.4,29.82 63.59,29.62 63.59,25.87 63.5,25.78 56.9,25.78 56.77,25.65 U10.2
SDA: length 22.1
  Top Layer w0.254: R29.2 61.22,35.31 61.1,35.18 61.1,33.77 61.53,33.34 61.53,32.28 61.1,31.85 61.1,30.47 61.34,30.23 63.75,30.23 64.01,29.97 64.01,27.87 64.52,27.37 64.52,26.67 64.01,26.16 64.01,25.71 63.67,25.37 62.95,25.37 62.59,25.02 61.42,25.02 61.07,25.37 60.72,25.37 60.36,25.02 59.28,25.02 58.93,25.37 58.27,25.37 58.04,25.15 U10.1
SN+: length 21.3
  Top Layer w0.254: CN4.2 42.04,54.36 42.04,49.91 42.41,49.54 55.68,49.54 55.88,49.35 U11.3
SN-: length 21.2
  Top Layer w0.254: U11.5 58.42,49.66 58.13,49.95 50.41,49.95 50.09,50.26 50.09,51.18 49.84,51.44 48.82,51.44 48.57,51.18 48.57,50.26 48.32,50.01 47.66,50.01 47.12,50.55 47.12,50.89 47.62,51.39 47.62,52.41 47.12,52.92 47.12,54.36 CN4.1
VRM: length 79.9
  Top Layer w0.61: 80.57,31 R24.2 80.33,21 D5.1 ; 80.57,31 80.57,31.62 ; 80.57,31 arc(80.39,31.44) 79.95,31.62 ; 80.57,31 arc(80.75,31.44) 81.19,31.62 ; 79.95,31.62 80.57,31.62 ; 79.95,31.62 79.88,31.62 ; 80.57,31.62 80.75,31.62 ; 80.57,31.62 80.57,31.8 ; D5.1 80.33,11.5 79.76,10.92 R25.1 ; D5.1 87.76,16 88.39,15.37 RELAY2.2 ; 81.19,31.62 87.88,31.62 88.26,31.24 88.26,29.72 RELAY1.2 ; 81.19,31.62 81.1,31.62 ; 80.33,32.4 80.33,32.07 80.31,32.05 ; 80.33,32.4 80.33,32.41 ; 80.33,32.4 arc(80.56,31.85) 81.1,31.62 ; 79.55,31.62 79.88,31.62 ; 79.55,31.62 R14.1 ; 79.55,31.62 arc(79.98,31.75) 80.27,32.1 ; 79.88,31.62 80.31,32.05 ; 80.75,31.62 81.1,31.62 ; 80.75,31.62 80.57,31.8 ; 80.31,32.05 80.27,32.1 ; 80.31,32.05 80.57,31.8 ; 80.27,32.1 arc(80.32,32.25) 80.33,32.41 ; U12.4 93.47,46.23 90.19,46.23 ; 90.19,46.23 89.41,46.23 88.73,45.55 C9.2 86.76,45.59 85.09,45.59 84.33,46.35 R2.2 82.87,46.36 81.03,46.36 80.38,45.7 R9.2 80.38,36.75 D3.1 80.33,32.41 ; 90.19,46.23 C10.2
XTAL1: length 11.2
  Top Layer w0.254: U10.10 46.61,24.94 47.04,25.37 47.04,28.48 46.95,28.58 C19.1 45.32,32.63 X1.2
XTAL2: length 11.2
  Top Layer w0.254: U10.9 47.88,24.94 47.45,25.37 47.45,28.48 47.54,28.58 C22.1 49.16,32.63 X1.1
$1N6010: length 19.4
  Top Layer w0.914: L1.2 19.64,28.27 20.78,29.42 U1.2
$1N7874: length 4.2
  Top Layer w0.254: U3.5 33.91,41.15 33.53,41.53 33.53,41.78 33.4,41.91 31.65,41.91 R3.2
$1N8048: length 6.4
  Top Layer w0.254: U3.6 36.26,40.2 36.45,40.39 36.45,42.8 36.19,43.05 35.56,43.05 35.18,43.43 35.18,44.65 C7.2
$1N8053: length 3.5
  Top Layer w0.254: U3.3 38.67,42.1 38.86,42.29 38.86,44.26 C7.1
$1N8284: length 3.1
  Top Layer w0.254: R1.2 LED1.2
$1N8627: length 29
  Top Layer w0.61: F1.2 16.46,40.95 16,41.4 1.52,41.4 0.51,42.42 0.51,49.53 0.89,49.91 2.11,49.91 SW1.1
$2N2031: length 11.7
  Top Layer w0.254: C16.1 60.72,42.99 R11.1 ; C16.1 62.25,42.78 62.36,42.67 62.36,41.15 62.61,40.89 63.83,40.89 R12.2 ; C16.1 60.96,42.82 U11.7
$2N2092: length 21
  Top Layer w0.254: U11.10 v1(58.42,53.85) ; v1(62.48,53.85) 63.75,53.85 64.01,53.59 64.01,43.07 R12.1 R13.2
  Bottom Layer w0.254: v1(62.48,53.85) v1(58.42,53.85)
$2N2099: length 10.1
  Top Layer w0.254: R4.1 61.72,55.69 61.72,55.42 ; R5.2 64.51,57.66 63.25,57.66 63.12,57.53 63.12,55.63 62.91,55.42 61.72,55.42 ; U11.9 59.69,54.7 60.4,55.42 61.72,55.42
$2N2266: length 48.6
  Top Layer w0.254: U11.2 54.61,44.83 54.36,44.58 52.2,44.58 51.94,44.32 R8.1 52.81,42.99 53.03,42.76 53.03,39.68 v1(53.09,39.62) ; v1(62.36,39.5) 67.82,39.5 67.95,39.62 67.95,53.59 67.44,54.1 C14.1 67.45,55.75 68.45,55.75 68.58,55.88 68.58,57.02 68.83,57.28 R10.1
  Bottom Layer w0.254: v1(62.36,39.5) 53.21,39.5 v1(53.09,39.62)
$2N2273: length 68.6
  Top Layer w0.254: v1(53.59,38.73) 52.2,38.73 51.94,38.99 R8.2 51.85,40.89 50.67,40.89 50.42,41.15 50.42,44.83 50.67,45.08 53.09,45.08 53.34,45.34 U11.1 ; v1(61.72,38.81) 68.2,38.81 68.45,39.07 68.45,54.99 69.34,55.88 74.17,55.88 74.42,56.13 74.42,58.04 74.04,58.42 68.71,58.42 68.33,58.04 67.71,58.04 C14.2 67.44,58.93 67.18,59.18 61.85,59.18 61.69,59.03 R4.2
  Bottom Layer w0.254: v1(53.59,38.73) 53.67,38.81 v1(61.72,38.81)
$2N2314: length 50.3
  Top Layer w0.254: R10.3 R10.2 75.56,55.63 75.18,55.25 69.85,55.25 68.91,54.31 68.91,38.35 68.66,38.1 61.21,38.1 60.93,38.39 C16.2 60.72,40.99 R11.2 57.84,40.89 57.02,40.89 56.77,41.15 56.77,43.56 57.28,44.07 59.44,44.07 59.69,44.32 U11.6
$2N3023: length 8.2
  Top Layer w0.254: R20.1 11.5,13.1 10.8,12.39 7.67,12.39 CN6.1
$2N3053: length 8.2
  Top Layer w0.254: R22.1 11.5,11.29 10.8,11.99 7.67,11.99 CN6.2
$2N3244: length 14
  Top Layer w0.254: U6.6 20.7,10.99 20.45,11.24 20.06,11.24 19.81,11.5 19.81,12.48 19.56,12.74 18.54,12.74 18.28,12.48 18.28,11.5 18.03,11.24 D4.1 17.13,9.51 16.91,9.29 R22.2
$2N3251: length 14.2
  Top Layer w0.254: R20.2 16.91,15.1 17.13,14.88 D4.2 20.77,13.14 21.97,11.94 U6.7
$2N3377: length 4.7
  Top Layer w0.406: R15.2 68.76,21.41 U4.2
$2N3466: length 14.9
  Top Layer w0.254: 72.58,37.32 72.63,37.27 72.63,31.62
  Top Layer w0.406: 72.63,31.62 R14.2 76.22,28.43 76.45,28.19 U4.4
$2N4164: length 3.6
  Top Layer w0.254: U8.2 68.76,1.72 R26.2
$2N4168: length 15.4
  Top Layer w0.254: 72.9,10.92 R25.2 76.22,7.73 76.58,7.37 U8.4 ; 72.9,10.92 72.58,11.24 Q2.1 ; 72.9,10.92 R27.1
$2N4738: length 3.6
  Top Layer w0.254: LED2.1 R9.1
$2N4742: length 29.5
  Top Layer w0.254: D3.2 73.91,36.7 73.53,37.08 73.53,41.53 73.41,41.66 72.33,41.66 LED2.2 71.63,41.21 71.63,35.32
  Top Layer w0.61: D3.2 v1(76.13,34.04)
  Bottom Layer w0.61: v1(76.13,34.04) 83.06,34.04 83.31,33.78 RELAY1.9
$2N4893: length 3.8
  Top Layer w0.254: LED3.1 R24.1
$2N4914: length 25.4
  Top Layer w0.254: v1(76.07,13.08) 76.13,13.14 D5.2 76.13,18.99 75.82,19.3 73.79,19.3 73.41,19.69 73.41,20.95 73.15,21.21 72.23,21.21 LED3.2 71.63,20.66 Q2.3
  Bottom Layer w0.254: v1(76.07,13.08) RELAY2.9
$2N5025: length 6.5
  Top Layer w0.254: R6.1 R7.1 55.96,52.26 U11.12
$2N7138: length 37.4
  Top Layer w0.254: v1(33.91,7.37) 33.53,6.99 17.02,6.99 16.76,6.73 H1.1 ; v1(37.72,8) 37.9,8 38.02,8.13 38.02,11.1 38.23,11.3 42.54,11.3 42.8,11.56 42.8,14.09
  Bottom Layer w0.254: v1(37.72,8) 34.04,8 33.91,7.87 v1(33.91,7.37)
$2N7141: length 39.1
  Top Layer w0.254: v1(37.34,8.76) 37.34,12.19 v1(37.21,12.32) 41.28,12.32 41.53,12.57 U10.15 ; v1(33.27,8.13) 33.27,7.75 33.02,7.49 14.61,7.49 14.22,7.11 H1.2
  Bottom Layer w0.254: v1(33.27,8.13) 33.27,8.64 33.4,8.76 v1(37.34,8.76)

## Copper pours and planes (outline as drawn; the poured copper is in the pictures)
GND on Top Layer: 23.24,34.92 26.67,34.92 26.67,30.61 23.24,30.61
GND on Top Layer: -5.72,67.31 108.33,67.31 108.33,-12.57 -5.72,-12.57
GND on Bottom Layer: -7.24,64.52 111,64.52 111,-6.1 -7.24,-6.1
VBAT on Top Layer: 1.14,51.18 19.81,51.18 19.81,40.64 1.14,40.64
VBAT on Top Layer: 19.48,56.01 33.91,56.01 33.91,44.7 19.48,44.7
VCC on Top Layer: 23.37,44.83 33.27,44.83 33.27,35.56 23.37,35.56
VCC on Top Layer: 28.07,37.97 38.48,37.97 38.48,20.83 28.07,20.83
$1N5406 on Top Layer: 2.79,39.88 13.97,39.88 13.97,35.3 2.79,35.3
$1N8627 on Top Layer: 15.24,40.26 17.91,40.26 17.91,31.24 15.24,31.24

Small or netless copper shapes (teardrops, artwork), in the pictures only: 352 on Top Layer, 23 on Bottom Layer

## Text on the board
Top Silkscreen Layer: GND | VCC | P15 | P16
